# EAGLE schematic Mini_VFD_RevA (EAGLE 9.6.2)
AUTH_NAME: Michael Adam; REV_NO: A
Assembly variants: Assembly_1

## Sheet 1 of 7: General
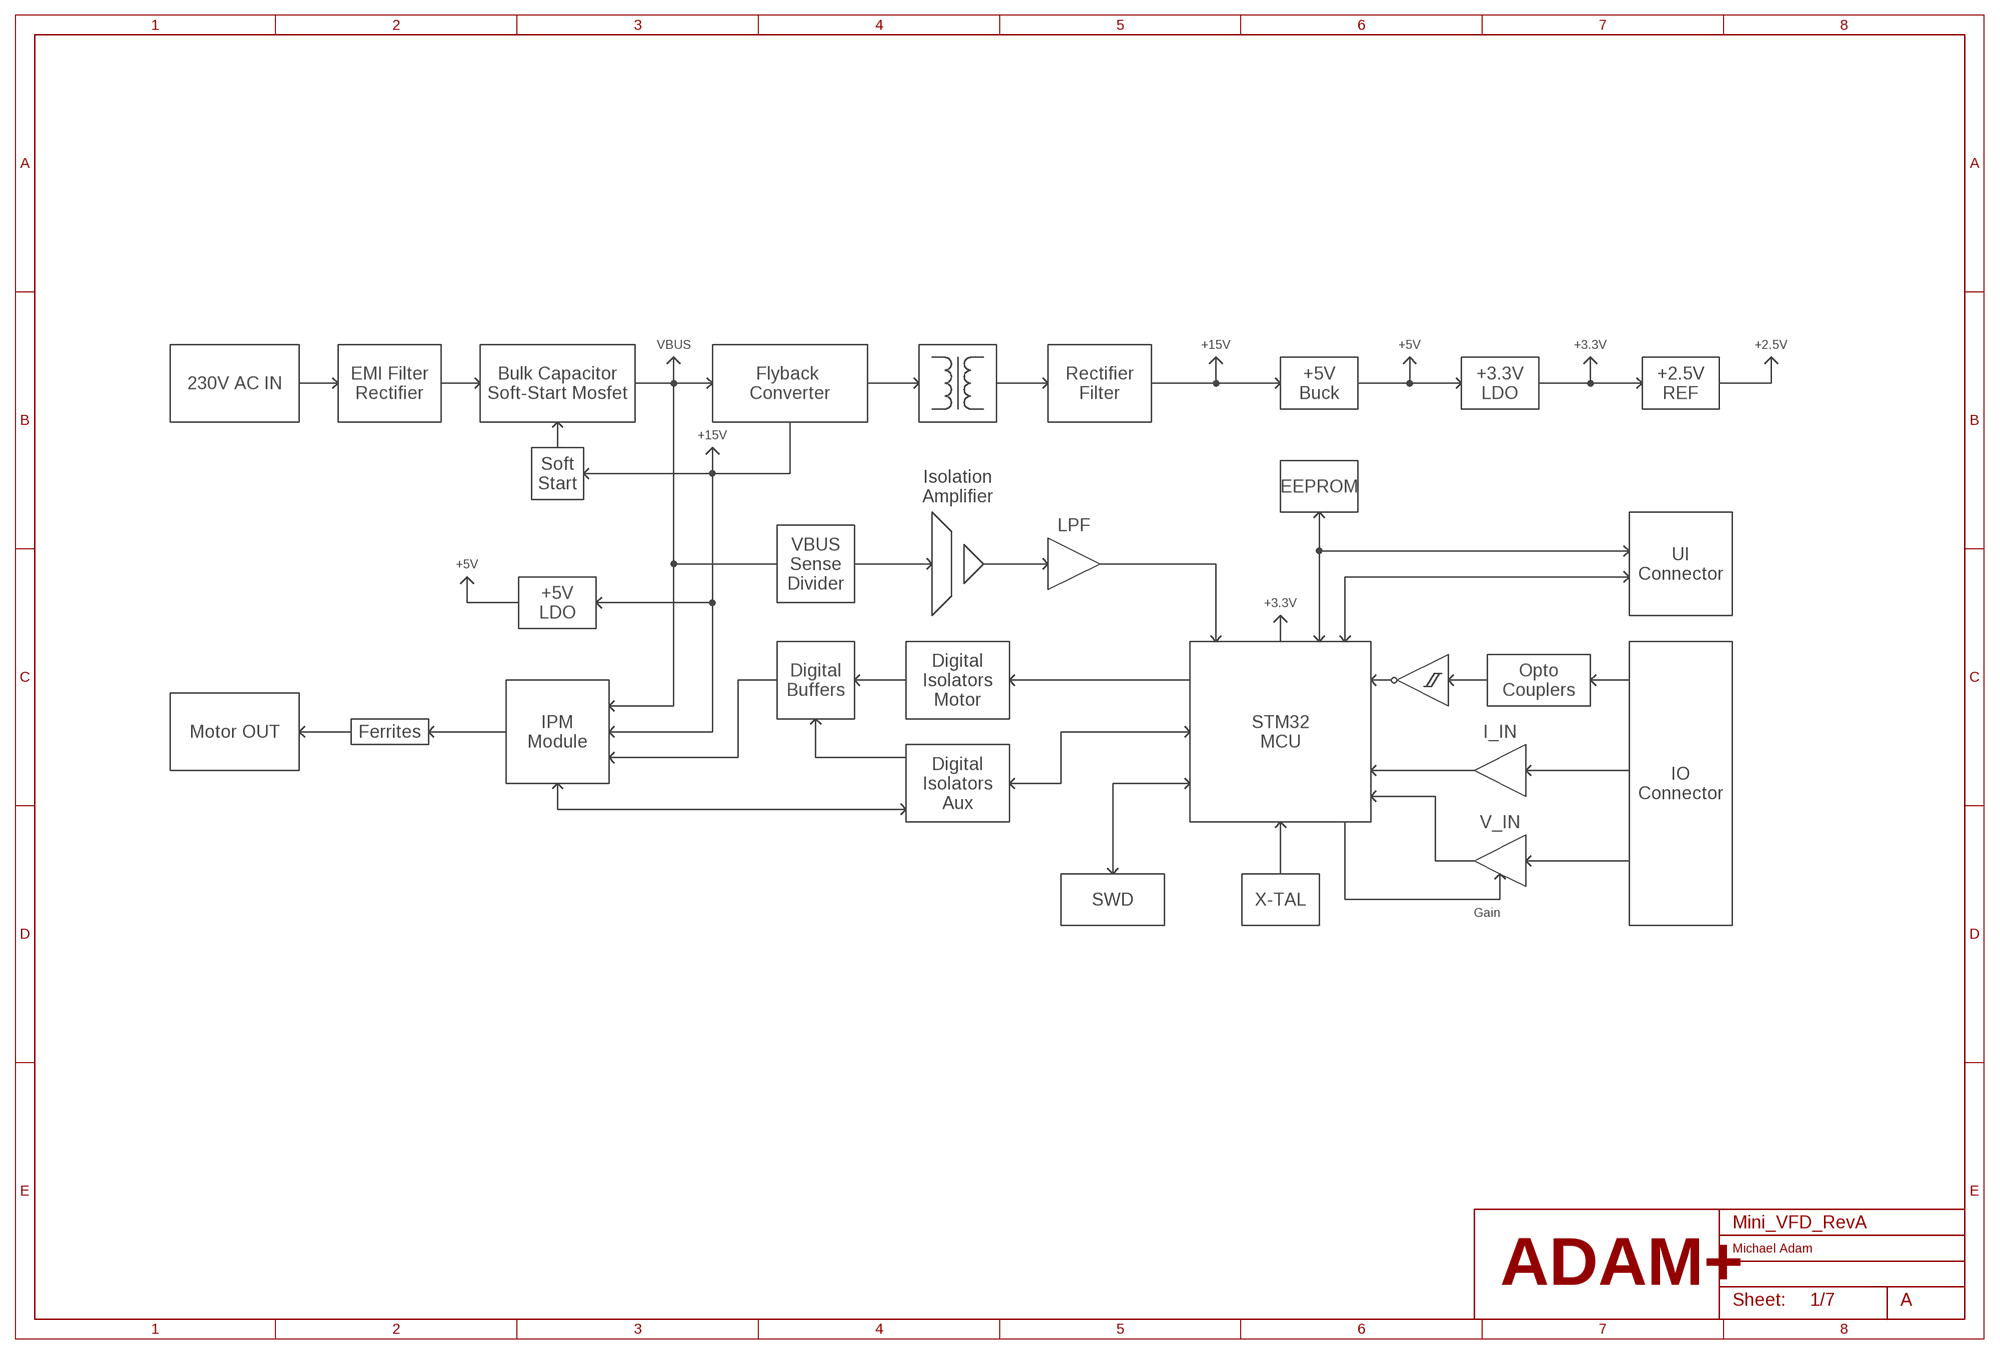
[diagram p0: schematic, sheet 1]

### Notes on the sheet
- VBUS | +15V | +5V | +3.3V | +2.5V
- 230V AC IN
- EMI Filter
  Rectifier
- Bulk Capacitor
  Soft-Start Mosfet
- Flyback 
  Converter
- Rectifier
  Filter
- +5V
  Buck
- +3.3V
  LDO
- +2.5V
  REF
- +15V
- Soft
  Start
- Isolation
  Amplifier
- EEPROM
- LPF
- +5V
- VBUS
  Sense
  Divider
- UI
  Connector
- +5V
  LDO
- +3.3V
- Digital
  Buffers
- Digital
  Isolators
  Motor
- Opto
  Couplers
- Motor OUT | Ferrites
- IPM
  Module
- STM32
  MCU
- I_IN
- Digital
  Isolators
  Aux
- IO
  Connector
- V_IN
- SWD | X-TAL
- Gain

## Sheet 2 of 7: Inputs
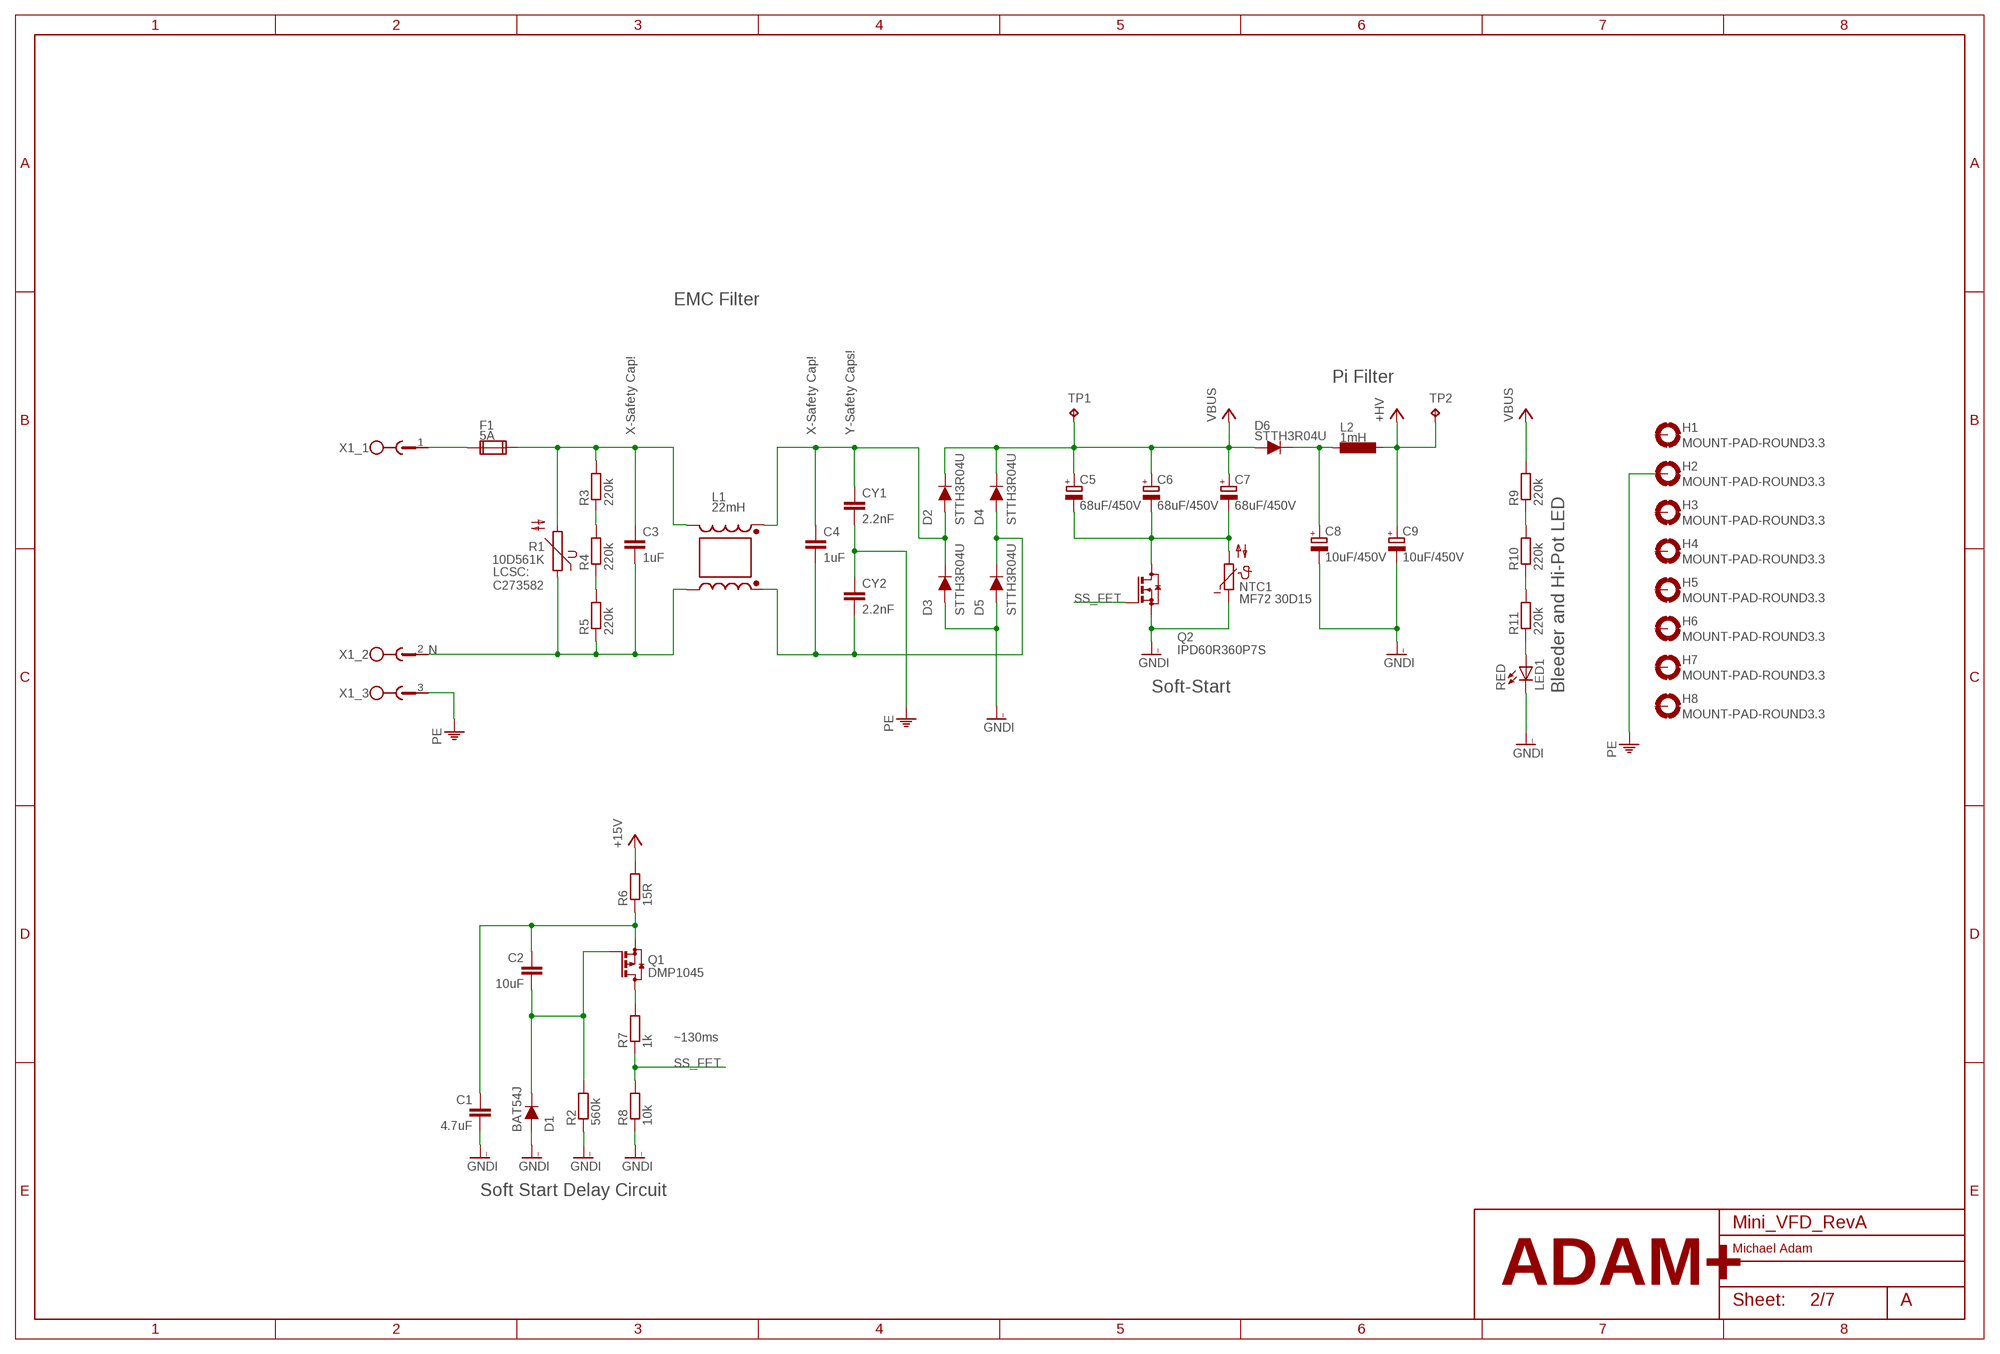
[diagram p1: schematic, sheet 2]

### Parts
C1  4.7uF  C-EUC0805  [C0805]
C2  10uF  C-EUC0805  [C0805]
C3  1uF  C-EU102-082X133  [C102-082X133]
C4  1uF  C-EU102-082X133  [C102-082X133]
C5  68uF/450V  CPOL-EUE7.5-18  [E7,5-18]
C6  68uF/450V  CPOL-EUE7.5-18  [E7,5-18]
C7  68uF/450V  CPOL-EUE7.5-18  [E7,5-18]
C8  10uF/450V  CPOL-EUE5-10.5  [E5-10,5]
C9  10uF/450V  CPOL-EUE5-10.5  [E5-10,5]
CY1  2.2nF  CYYC7B5  [YC7B5]
CY2  2.2nF  CYYC7B5  [YC7B5]
D1  BAT54J  DIODE  [SOD123]
D2  STTH3R04U  DIODESMB  [SMB]
D3  STTH3R04U  DIODESMB  [SMB]
D4  STTH3R04U  DIODESMB  [SMB]
D5  STTH3R04U  DIODESMB  [SMB]
D6  STTH3R04U  DIODESMB  [SMB]
F1  5A  FUSESH25  [SH25]
H1  MOUNT-PAD-ROUND3.3  [3,3-PAD]
H2  MOUNT-PAD-ROUND3.3  [3,3-PAD]
H3  MOUNT-PAD-ROUND3.3  [3,3-PAD]
H4  MOUNT-PAD-ROUND3.3  [3,3-PAD]
H5  MOUNT-PAD-ROUND3.3  [3,3-PAD]
H6  MOUNT-PAD-ROUND3.3  [3,3-PAD]
H7  MOUNT-PAD-ROUND3.3  [3,3-PAD]
H8  MOUNT-PAD-ROUND3.3  [3,3-PAD]
L1  22mH  COMMON_MODE_CHOKE_XRT16128B-223VFRL6  [CMC_PDMCAT18107]
L2  1mH  COIL_1MH  [SLH0704]
LED1  RED  LED_0805  [LED_0805]
NTC1  MF72 30D15  NTC  [MF72]
Q1  DMP1045  PMOS  [SOT23]
Q2  IPD60R360P7S  NMOS_IPD60R360P7S  [TO252]
R1  10D561K  S10K175  [S10K175]
R2  560k  R-EU_R0603  [R0603]
R3  220k  R-EU_R1206  [R1206]
R4  220k  R-EU_R1206  [R1206]
R5  220k  R-EU_R1206  [R1206]
R6  15R  R-EU_0207/10  [0207/10]
R7  1k  R-EU_R0603  [R0603]
R8  10k  R-EU_R0603  [R0603]
R9  220k  R-EU_R1206  [R1206]
R10  220k  R-EU_R1206  [R1206]
R11  220k  R-EU_R1206  [R1206]
TP1  TPTP10R  [TP10R]
TP2  TPTP10R  [TP10R]
X1  MSTBV3  [MSTBV3]

### Nets
+15V: R6.2 ; also sheet 3,4
+HV [High_Voltage]: C9.+ L2.1 TP2.TP ; also sheet 3
C_NEG: C5.- C6.- C7.- NTC1.2 Q2.3(D)
GNDI: C1.2 C8.- C9.- D1.2(A) D3.A D5.A LED1.C NTC1.1 Q2.2(S) R2.1 R8.1 ; also sheet 3,4,5
L: F1.1 X1.1
L_FILT [High_Voltage]: C4.1 CY1.1 D2.A D3.C L1.IN1
L_FUSED: C3.1 F1.2 L1.OUT1 R1.2 R3.2
N: C3.2 L1.OUT2 R1.1 R5.1 X1.2
N$1: Q1.3(D) R7.2
N$12: C2.2 D1.1(C) Q1.1(G) R2.2
N$14: C1.1 C2.1 Q1.2(S) R6.1
N$44: R3.1 R4.2
N$45: R4.1 R5.2
N$59: R9.1 R10.2
N$63: R10.1 R11.2
N$64: LED1.A R11.1
N_FILT [High_Voltage]: C4.2 CY2.2 D4.A D5.C L1.IN2
PE: CY1.2 CY2.1 H2.B3,3(MOUNT) X1.3 ; also sheet 4
SS_FET: Q2.1(G) R7.1 R8.2
VBUS [High_Voltage]: C5.+ C6.+ C7.+ D2.C D4.C D6.A R9.2 TP1.TP ; also sheet 4,5
VBUS_FILT [High_Voltage]: C8.+ D6.C L2.2
Unconnected: H1.B3,3(MOUNT) H3.B3,3(MOUNT) H4.B3,3(MOUNT) H5.B3,3(MOUNT) H6.B3,3(MOUNT) H7.B3,3(MOUNT) H8.B3,3(MOUNT)

### Notes on the sheet
- EMC Filter
- Pi Filter
- X-Safety Cap! | X-Safety Cap! | Y-Safety Caps!
- LCSC:
  C273582
- Soft-Start | Bleeder and Hi-Pot LED
- ~130ms
- Soft Start Delay Circuit

## Sheet 3 of 7: Inputs
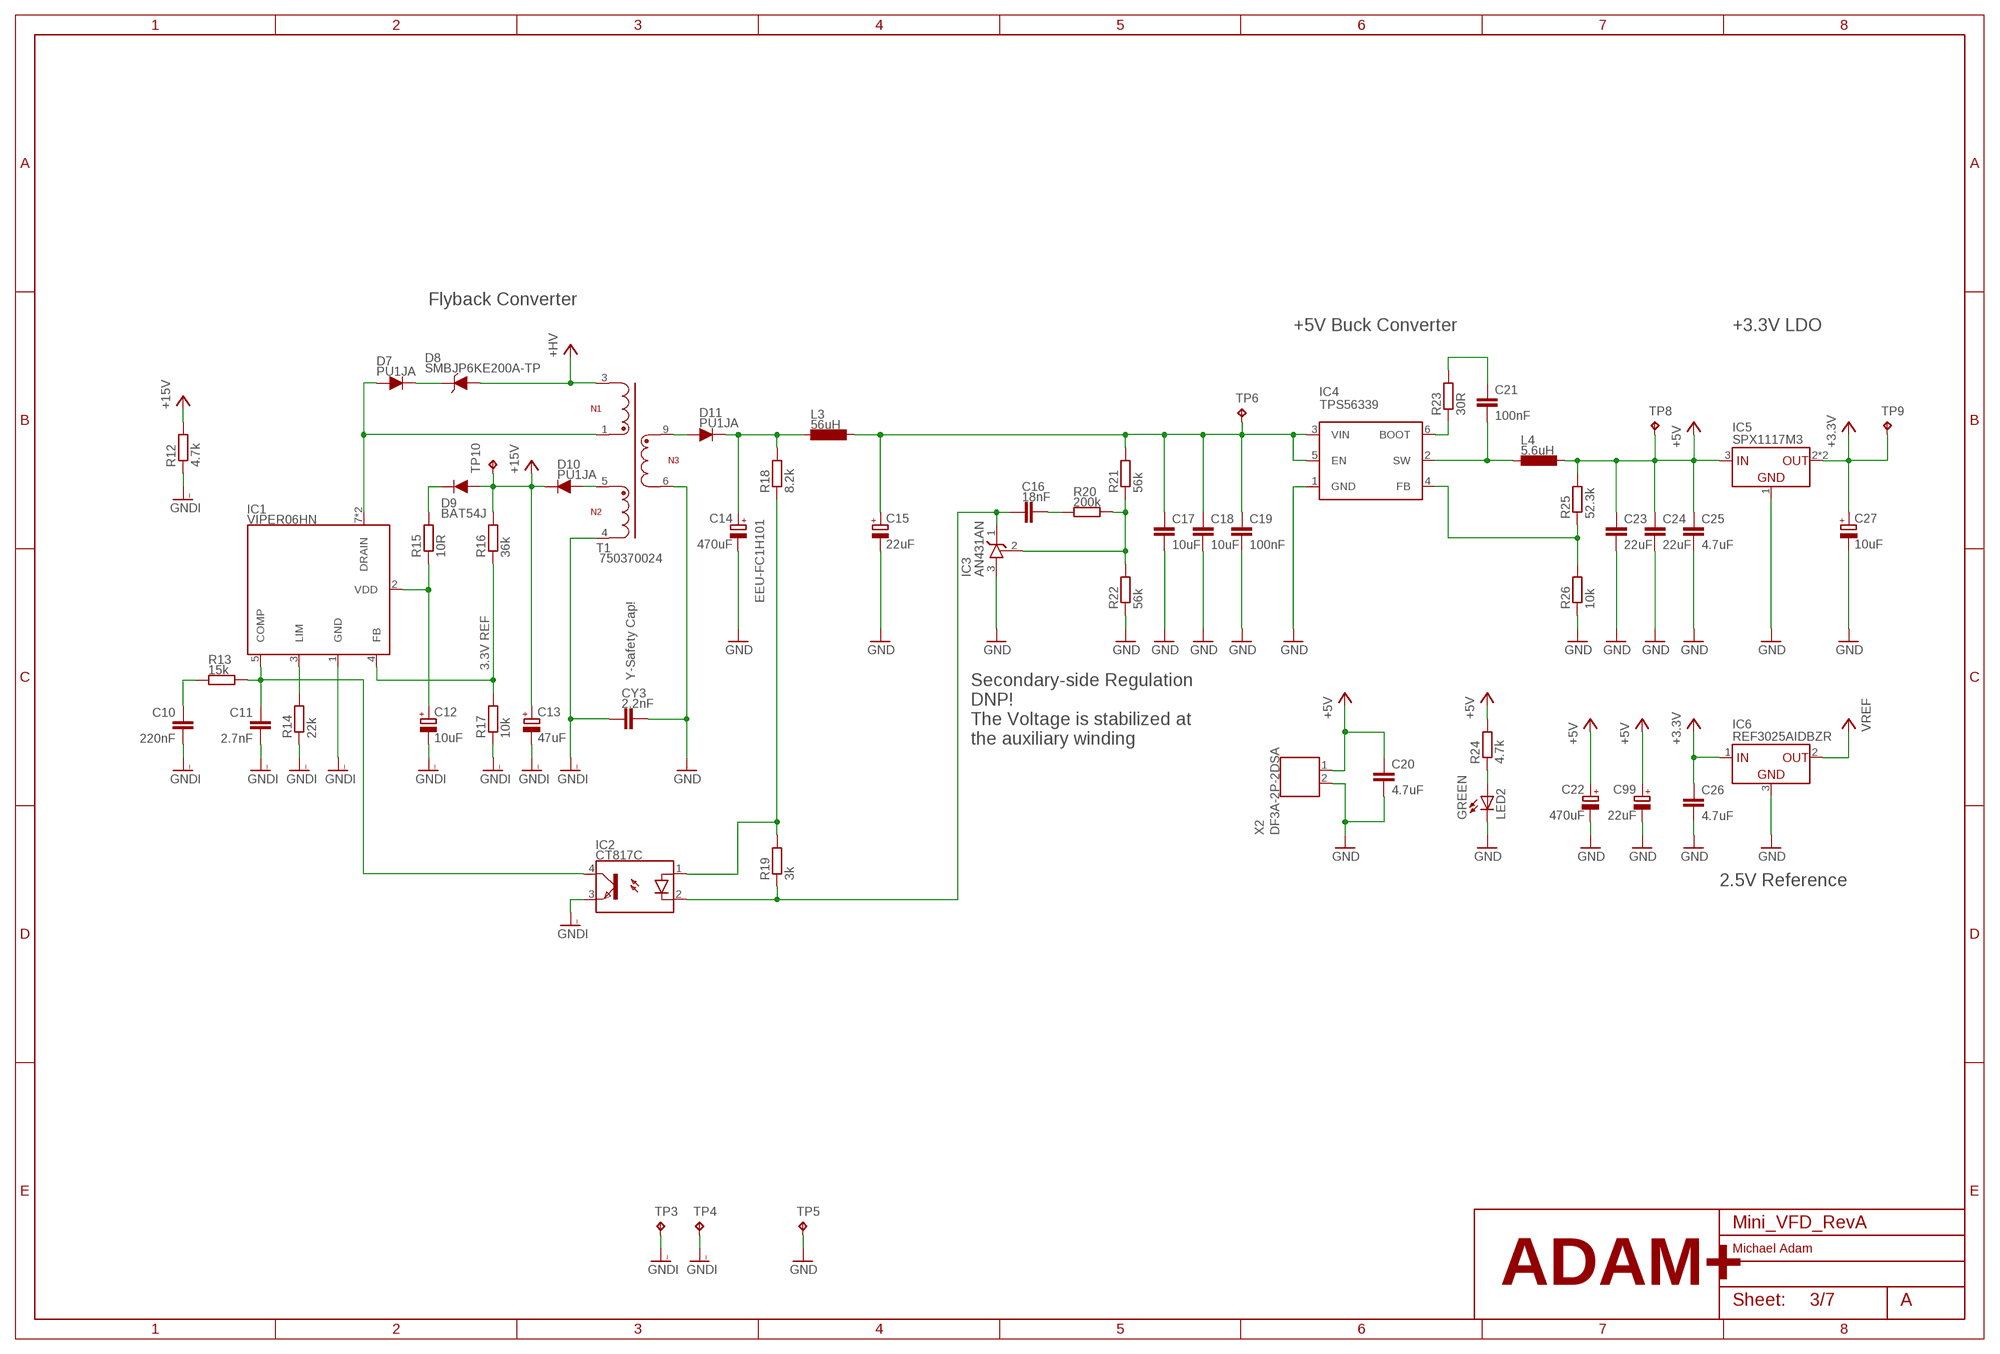
[diagram p2: schematic, sheet 3]

### Parts
C10  220nF  C-EUC0603  [C0603]
C11  2.7nF  C-EUC0603  [C0603]
C12  10uF  CPOL-EUE2.5-5  [E2,5-5]
C13  47uF  CPOL-EUE2.5-7  [E2,5-7]
C14  470uF  CPOL-EUE5-10.5  [E5-10,5]
C15  22uF  CPOL-EUE2-5  [E2-5]
C16  18nF  C-EUC0603  [C0603]  (not fitted in variant Assembly_1)
C17  10uF  C-EUC1206  [C1206]
C18  10uF  C-EUC1206  [C1206]
C19  100nF  C-EUC0603  [C0603]
C20  4.7uF  C-EUC0805  [C0805]
C21  100nF  C-EUC0603  [C0603]
C22  470uF  CPOL-EUE5-10.5  [E5-10,5]
C23  22uF  C-EUC1206  [C1206]
C24  22uF  C-EUC1206  [C1206]
C25  4.7uF  C-EUC0603  [C0603]
C26  4.7uF  C-EUC0603  [C0603]
C27  10uF  CPOL-EUCT3528  [CT3528]
C99  22uF  CPOL-EUE2-5  [E2-5]
CY3  2.2nF  CYYC7B5  [YC7B5]
D7  PU1JA  DIODEDO214AC  [DO214AC]
D8  SMBJP6KE200A-TP  TVS_DIODE_UNISMB  [SMB]
D9  BAT54J  DIODE  [SOD123]
D10  PU1JA  DIODEDO214AC  [DO214AC]
D11  PU1JA  DIODEDO214AC  [DO214AC]
IC1  VIPER06HN  [DIL07]
IC2  CT817C  [SMD4]  (not fitted in variant Assembly_1)
IC3  AN431AN  431  [SOT23]  (not fitted in variant Assembly_1)
IC4  TPS56339  [TSOT23-6]
IC5  SPX1117M3  SPX1117_3V3  [SOT223]
IC6  REF3025AIDBZR  REF3025  [SOT23]
L3  56uH  COIL_56UH  [PDPTAT]
L4  5.6uH  COIL_5R6  [DH0530H]
LED2  GREEN  LED_0805  [LED_0805]
R12  4.7k  R-EU_R1206  [R1206]
R13  15k  R-EU_R0603  [R0603]
R14  22k  R-EU_R0603  [R0603]
R15  10R  R-EU_R0805  [R0805]
R16  36k  R-EU_R0603  [R0603]
R17  10k  R-EU_R0603  [R0603]
R18  8.2k  R-EU_R0603  [R0603]  (not fitted in variant Assembly_1)
R19  3k  R-EU_R0603  [R0603]  (not fitted in variant Assembly_1)
R20  200k  R-EU_R0603  [R0603]  (not fitted in variant Assembly_1)
R21  56k  R-EU_R0603  [R0603]  (not fitted in variant Assembly_1)
R22  56k  R-EU_R0603  [R0603]  (not fitted in variant Assembly_1)
R23  30R  R-EU_R0603  [R0603]
R24  4.7k  R-EU_R0603  [R0603]
R25  52.3k  R-EU_R0603  [R0603]
R26  10k  R-EU_R0603  [R0603]
T1  750370024  750370024  [WE-OLSTM_EE13_L13.72W20.45H10.8]
TP3  TP_SOLDREYE  [SOLDER_EYE]
TP4  TP_SOLDREYE  [SOLDER_EYE]
TP5  TP_SOLDREYE  [SOLDER_EYE]
TP6  TP_SOLDREYE  [SOLDER_EYE]
TP8  TP_SOLDREYE  [SOLDER_EYE]
TP9  TP_SOLDREYE  [SOLDER_EYE]
TP10  TP_SOLDREYE  [SOLDER_EYE]
X2  DF3A-2P-2DSA  DF3E-2P-2V_THD  [DF3A-2P-2DSA]

### Nets
+3.3V: C26.1 C27.+ IC5.2(VOUT) IC5.4(VOUT) IC6.1(VIN) TP9.1(TP) ; also sheet 5,6,7
+5V: C20.1 C22.+ C23.1 C24.1 C25.1 C99.+ IC5.3(VIN) L4.P$1 R24.2 R25.2 TP8.1(TP) X2.1 ; also sheet 6,7
+15V: C13.+ D9.2(A) D10.C R12.2 R16.2 TP10.1(TP) ; also sheet 2,4
+HV [High_Voltage]: D8.A T1.3 ; also sheet 2
AUX_OUT: D10.A T1.5
BOOT_+5V: IC4.6(BOOT) R23.1
D [High_Voltage]: D7.A IC1.7(DRAIN) IC1.8(DRAIN) T1.1
FB: IC4.4(FB) R25.1 R26.2
GND: C14.- C15.- C17.2 C18.2 C19.2 C20.2 C22.- C23.2 C24.2 C25.2 C26.2 C27.- C99.- CY3.2 IC3.3(A) IC4.1(GND) IC5.1(GND) IC6.3(GND) LED2.C R22.1 R26.1 T1.6 TP5.1(TP) X2.2 ; also sheet 5,6,7
GNDI: C10.2 C11.2 C12.- C13.- CY3.1 IC1.1(GND) IC2.3(EMIT) R12.1 R14.1 R17.1 T1.4 TP3.1(TP) TP4.1(TP) ; also sheet 2,4,5
N$48: D9.1(C) R15.2
N$50: IC1.3(LIM) R14.2
N$52: IC1.4(FB) R16.1 R17.2
N$55: C10.1 R13.1
N$56: IC3.2(R) R20.2 R21.1 R22.2
N$57: D7.C D8.C
N$60: C11.1 IC1.5(COMP) IC2.4(COL) R13.2
N$62: C16.1 IC2.2(C) IC3.1(C) R19.1
N$67: IC2.1(A) R18.1 R19.2
N$68: LED2.A R24.1
N$69: C16.2 R20.1
N$75: C21.1 R23.2
SEC_OUT: D11.A T1.9
SW: C21.2 IC4.2(SW) L4.P$2
V_AUX: C12.+ IC1.2(VDD) R15.1
VDD: C14.+ D11.C L3.2 R18.2
VDD_FILT: C15.+ C17.1 C18.1 C19.1 IC4.3(VIN) IC4.5(EN) L3.1 R21.2 TP6.1(TP)
VREF: IC6.2(VOUT) ; also sheet 7

### Notes on the sheet
- Flyback Converter
- +5V Buck Converter | +3.3V LDO
- EEU-FC1H101
- 3.3V REF
- Y-Safety Cap!
- Secondary-side Regulation
  DNP!
  The Voltage is stabilized at 
  the auxiliary winding
- 2.5V Reference

## Sheet 4 of 7: Outputs
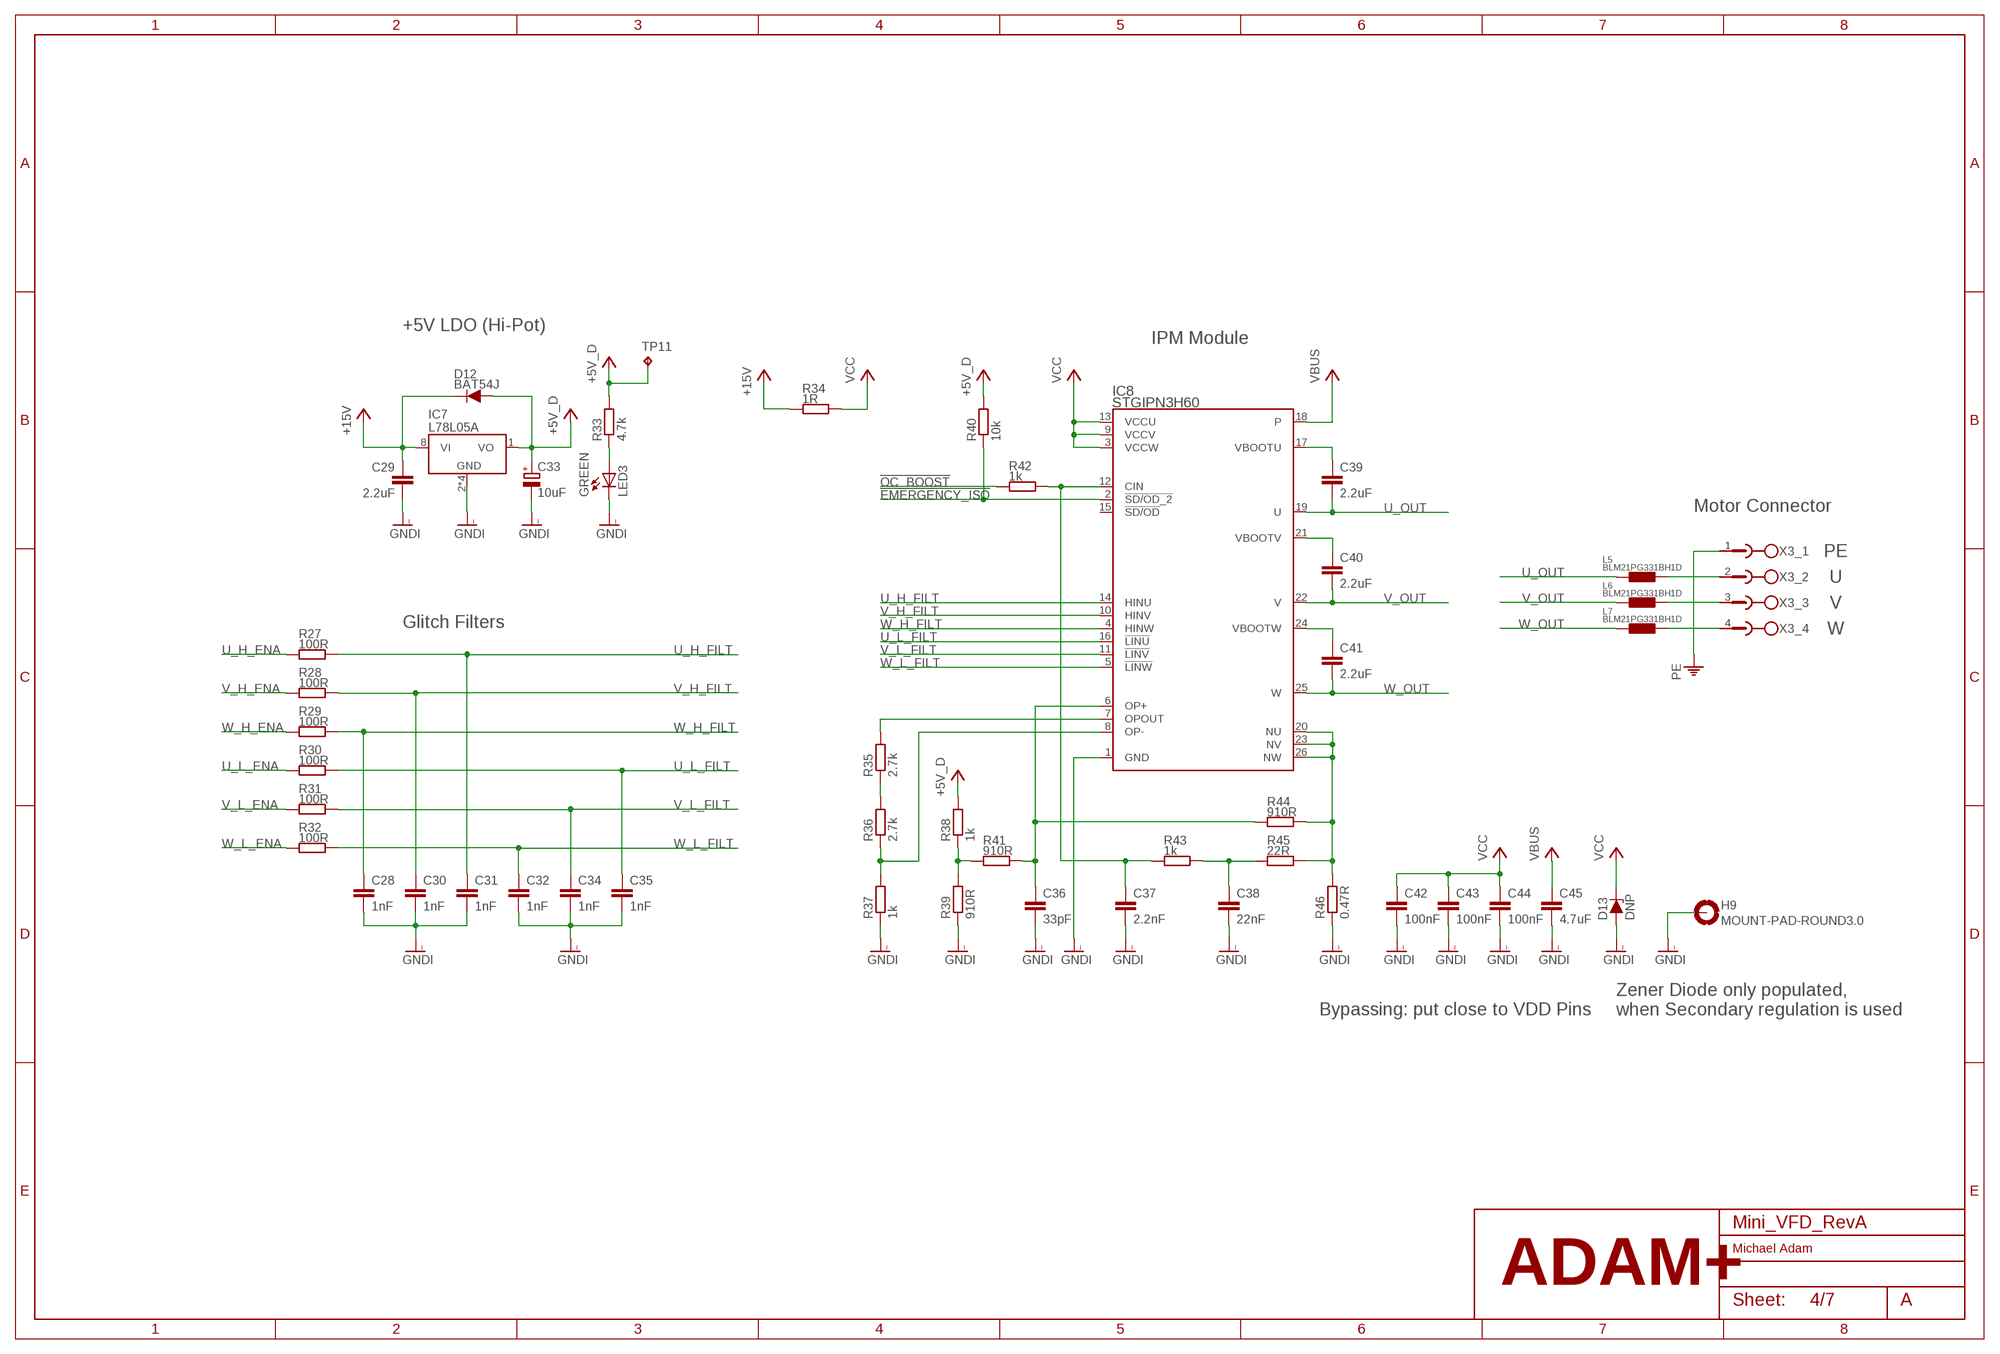
[diagram p3: schematic, sheet 4]

### Parts
C28  1nF  C-EUC0603  [C0603]
C29  2.2uF  C-EUC0805  [C0805]
C30  1nF  C-EUC0603  [C0603]
C31  1nF  C-EUC0603  [C0603]
C32  1nF  C-EUC0603  [C0603]
C33  10uF  CPOL-EUCT3528  [CT3528]
C34  1nF  C-EUC0603  [C0603]
C35  1nF  C-EUC0603  [C0603]
C36  33pF  C-EUC0603  [C0603]
C37  2.2nF  C-EUC0603  [C0603]
C38  22nF  C-EUC0603  [C0603]
C39  2.2uF  C-EUC0805  [C0805]
C40  2.2uF  C-EUC0805  [C0805]
C41  2.2uF  C-EUC0805  [C0805]
C42  100nF  C-EUC0603  [C0603]
C43  100nF  C-EUC0603  [C0603]
C44  100nF  C-EUC0603  [C0603]
C45  4.7uF  C-EU275-126X316  [C275-126X316]
D12  BAT54J  DIODE  [SOD123]
D13  DNP  ZENERSMA  [DO214AC]
H9  MOUNT-PAD-ROUND3.0  [3,0-PAD]
IC7  L78L05A  78L05  [SOIC8]
IC8  STGIPN3H60  [NDIP26_12P45X29P25_STM]
L5  BLM21PG331BH1D  BEAD0805  [R0805]
L6  BLM21PG331BH1D  BEAD0805  [R0805]
L7  BLM21PG331BH1D  BEAD0805  [R0805]
LED3  GREEN  LED_0805  [LED_0805]
R27  100R  R-EU_R0603  [R0603]
R28  100R  R-EU_R0603  [R0603]
R29  100R  R-EU_R0603  [R0603]
R30  100R  R-EU_R0603  [R0603]
R31  100R  R-EU_R0603  [R0603]
R32  100R  R-EU_R0603  [R0603]
R33  4.7k  R-EU_R0603  [R0603]
R34  1R  R-EU_R0805  [R0805]
R35  2.7k  R-EU_R0603  [R0603]
R36  2.7k  R-EU_R0603  [R0603]
R37  1k  R-EU_R0603  [R0603]
R38  1k  R-EU_R0603  [R0603]
R39  910R  R-EU_R0603  [R0603]
R40  10k  R-EU_R0603  [R0603]
R41  910R  R-EU_R0603  [R0603]
R42  1k  R-EU_R0603  [R0603]
R43  1k  R-EU_R0603  [R0603]
R44  910R  R-EU_R0603  [R0603]
R45  22R  R-EU_R0603  [R0603]
R46  0.47R  R-EU_R2512  [R2512]
TP11  TP_SOLDREYE  [SOLDER_EYE]
X3  MSTBV4MTSV  [MSTBV4]

### Nets
!EMERGENCY_ISO: IC8.2(!SD/OD_2) R40.1 ; also sheet 5
!OC_BOOST: R42.1 ; also sheet 5
+5V_D: C33.+ D12.2(A) IC7.1(VO) R33.2 R38.2 R40.2 TP11.1(TP) ; also sheet 5
+15V: C29.1 D12.1(C) IC7.8(VI) R34.1 ; also sheet 2,3
BOOT_U [High_Voltage]: C39.1 IC8.17(VBOOTU)
BOOT_V [High_Voltage]: C40.1 IC8.21(VBOOTV)
BOOT_W [High_Voltage]: C41.1 IC8.24(VBOOTW)
GNDI: C28.2 C29.2 C30.2 C31.2 C32.2 C33.- C34.2 C35.2 C36.2 C37.2 C38.2 C42.2 C43.2 C44.2 C45.2 D13.A H9.B3,0(MOUNT) IC7.2(GND) IC7.3(GND) IC7.6(GND) IC7.7(GND) IC8.1(GND) LED3.C R37.1 R39.1 R46.1 ; also sheet 2,3,5
N$2: LED3.A R33.1
N$5: C38.1 R43.2 R45.1
N$6: C37.1 IC8.12(CIN) R42.2 R43.1
N$7: IC8.8(OP-) R36.1 R37.2
N$8: R35.1 R36.2
N$9: IC8.7(OPOUT) R35.2
N$22: R38.1 R39.2 R41.1
N$38: C36.1 IC8.6(OP+) R41.2 R44.1
N_COM: IC8.20(NU) IC8.23(NV) IC8.26(NW) R44.2 R45.2 R46.2
PE: X3.1 ; also sheet 2
U [High_Voltage]: L5.2 X3.2
U_H_ENA: R27.1 ; also sheet 5
U_H_FILT: C31.1 IC8.14(HINU) R27.2
U_L_ENA: R30.1 ; also sheet 5
U_L_FILT: C35.1 IC8.16(!LINU) R30.2
U_OUT [High_Voltage]: C39.2 IC8.19(U) L5.1
V [High_Voltage]: L6.2 X3.3
V_H_ENA: R28.1 ; also sheet 5
V_H_FILT: C30.1 IC8.10(HINV) R28.2
V_L_ENA: R31.1 ; also sheet 5
V_L_FILT: C34.1 IC8.11(!LINV) R31.2
V_OUT [High_Voltage]: C40.2 IC8.22(V) L6.1
VBUS [High_Voltage]: C45.1 IC8.18(P) ; also sheet 2,5
VCC: C42.1 C43.1 C44.1 D13.C IC8.3(VCCW) IC8.9(VCCV) IC8.13(VCCU) R34.2
W [High_Voltage]: L7.2 X3.4
W_H_ENA: R29.1 ; also sheet 5
W_H_FILT: C28.1 IC8.4(HINW) R29.2
W_L_ENA: R32.1 ; also sheet 5
W_L_FILT: C32.1 IC8.5(!LINW) R32.2
W_OUT [High_Voltage]: C41.2 IC8.25(W) L7.1
Unconnected: IC8.15(!SD/OD)

### Notes on the sheet
- +5V LDO (Hi-Pot)
- IPM Module
- Motor Connector
- PE
- U
- V
- Glitch Filters | W
- Bypassing: put close to VDD Pins
- Zener Diode only populated, 
  when Secondary regulation is used

## Sheet 5 of 7
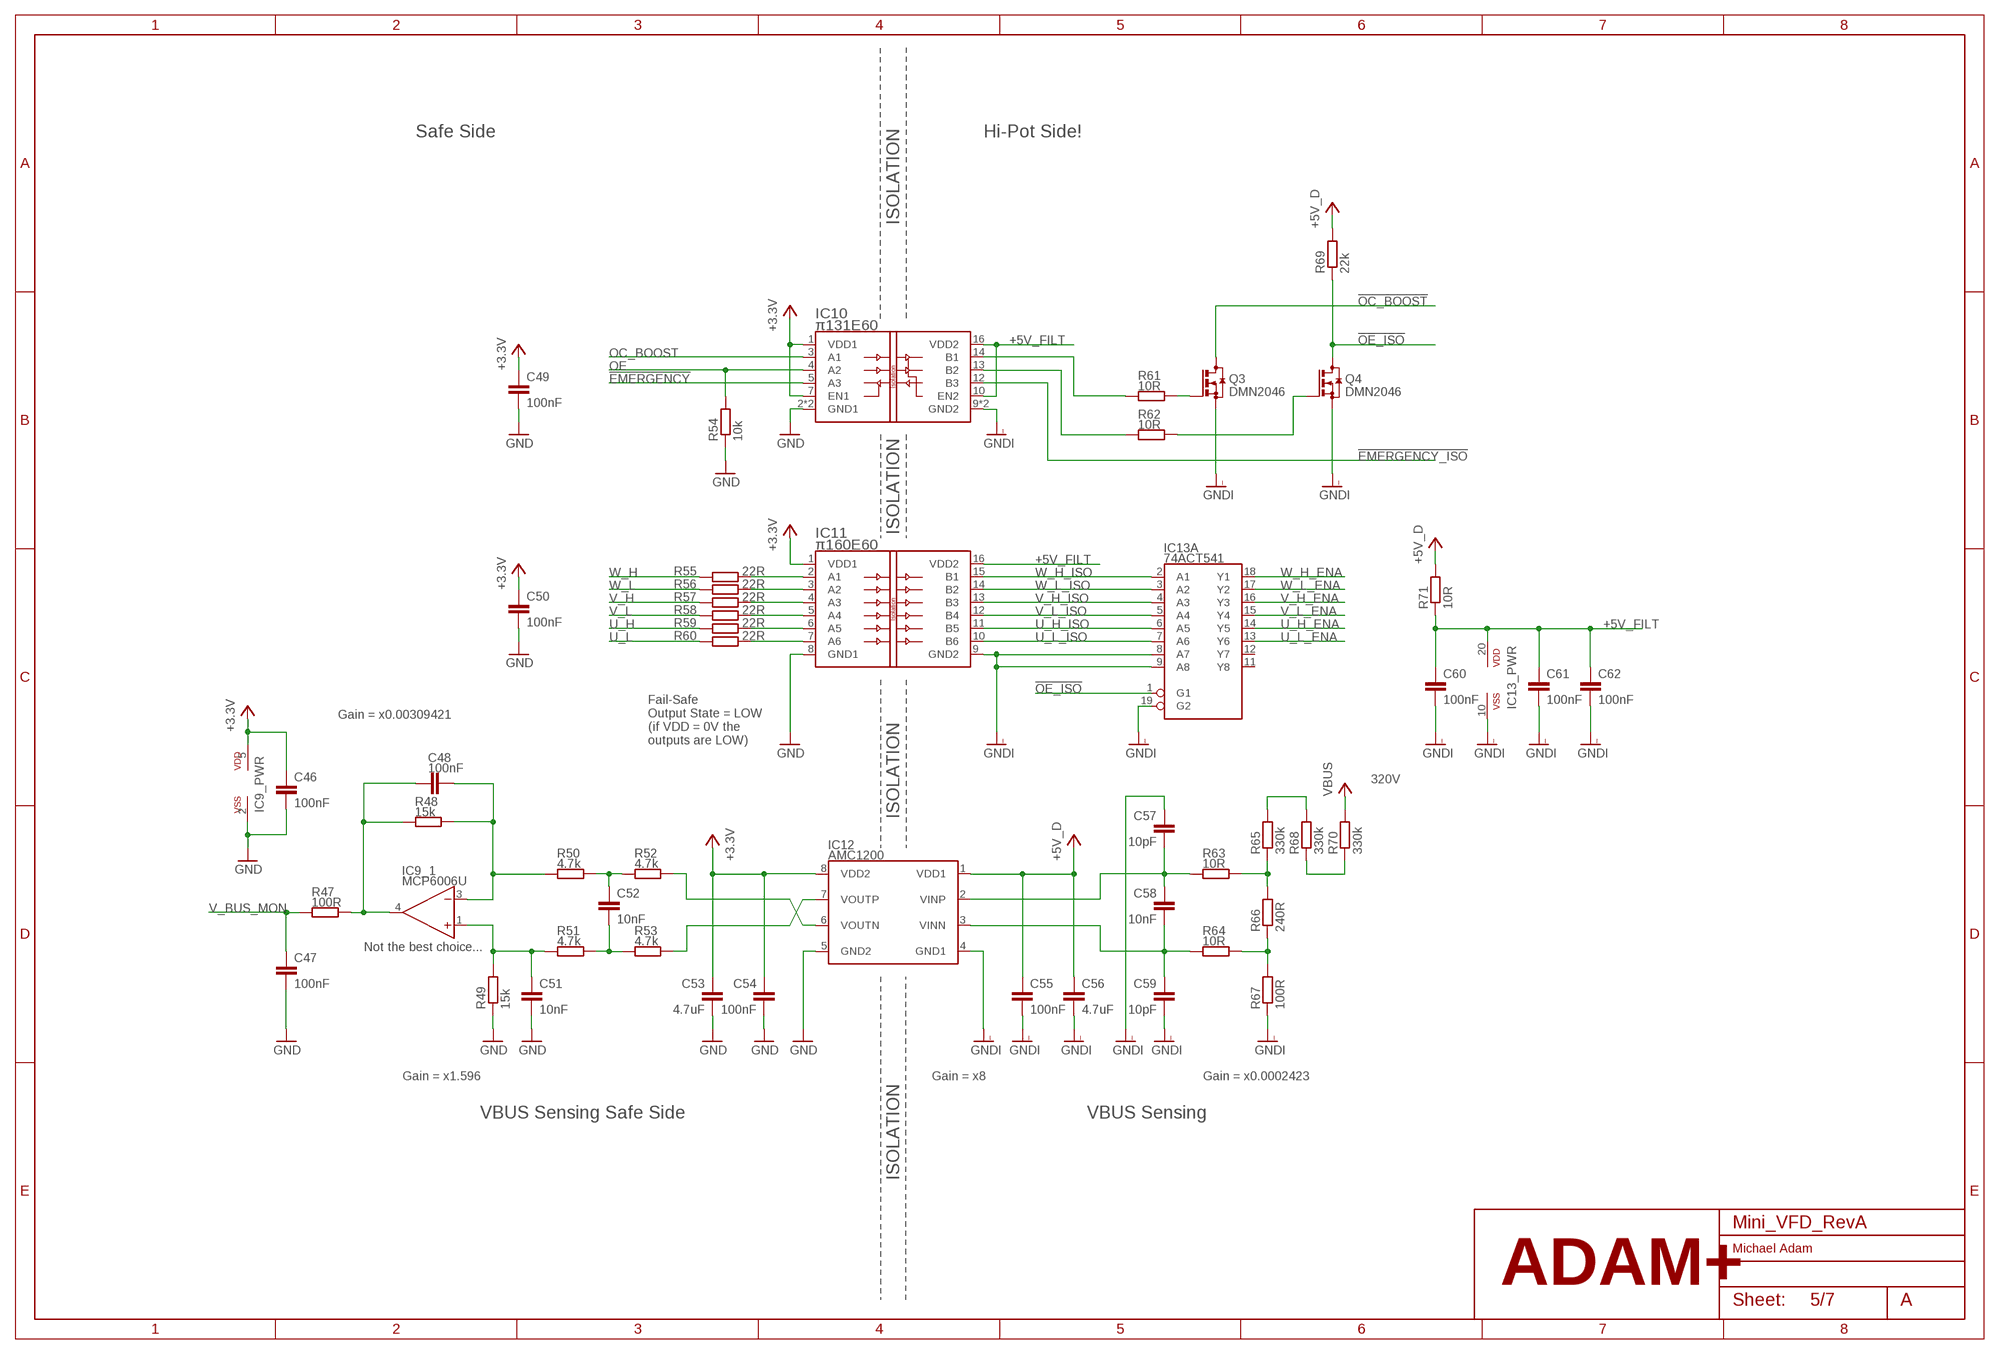
[diagram p4: schematic, sheet 5]

### Parts
C46  100nF  C-EUC0603  [C0603]
C47  100nF  C-EUC0603  [C0603]
C48  100nF  C-EUC0603  [C0603]
C49  100nF  C-EUC0603  [C0603]
C50  100nF  C-EUC0603  [C0603]
C51  10nF  C-EUC0603  [C0603]
C52  10nF  C-EUC0603  [C0603]
C53  4.7uF  C-EUC0603  [C0603]
C54  100nF  C-EUC0603  [C0603]
C55  100nF  C-EUC0603  [C0603]
C56  4.7uF  C-EUC0603  [C0603]
C57  10pF  C-EUC0603  [C0603]
C58  10nF  C-EUC0603  [C0603]
C59  10pF  C-EUC0603  [C0603]
C60  100nF  C-EUC0603  [C0603]
C61  100nF  C-EUC0603  [C0603]
C62  100nF  C-EUC0603  [C0603]
IC9  MCP6006U  LM321  [SOT23-5]
IC10  π131E60  [SOIC16R]
IC11  π160E60  [SOIC16R]
IC12  AMC1200  [SOIC8_W]
IC13  74ACT541  74541  [SOIC20NS]
Q3  DMN2046  NMOS_DMN2046  [SOT23]
Q4  DMN2046  NMOS_DMN2046  [SOT23]
R47  100R  R-EU_R0603  [R0603]
R48  15k  R-EU_R0603  [R0603]
R49  15k  R-EU_R0603  [R0603]
R50  4.7k  R-EU_R0603  [R0603]
R51  4.7k  R-EU_R0603  [R0603]
R52  4.7k  R-EU_R0603  [R0603]
R53  4.7k  R-EU_R0603  [R0603]
R54  10k  R-EU_R0603  [R0603]
R55  22R  R-EU_R0603  [R0603]
R56  22R  R-EU_R0603  [R0603]
R57  22R  R-EU_R0603  [R0603]
R58  22R  R-EU_R0603  [R0603]
R59  22R  R-EU_R0603  [R0603]
R60  22R  R-EU_R0603  [R0603]
R61  10R  R-EU_R0603  [R0603]
R62  10R  R-EU_R0603  [R0603]
R63  10R  R-EU_R0603  [R0603]
R64  10R  R-EU_R0603  [R0603]
R65  330k  R-EU_R1206  [R1206]
R66  240R  R-EU_R0603  [R0603]
R67  100R  R-EU_R0603  [R0603]
R68  330k  R-EU_R1206  [R1206]
R69  22k  R-EU_R0603  [R0603]
R70  330k  R-EU_R1206  [R1206]
R71  10R  R-EU_R0603  [R0603]

### Nets
!EMERGENCY: IC10.5(A3) ; also sheet 7
!EMERGENCY_ISO: IC10.12(B3) ; also sheet 4
!OC_BOOST: Q3.3(D) ; also sheet 4
!OE_ISO: IC13.1(A:G1) Q4.3(D) R69.1
+3.3V: C46.1 C49.1 C50.1 C53.1 C54.1 IC9.5(_PWR:VDD) IC10.1(VDD1) IC10.7(EN1) IC11.1(VDD1) IC12.8(VDD2) ; also sheet 3,6,7
+5V_D: C55.1 C56.1 IC12.1(VDD1) R69.2 R71.2 ; also sheet 4
+5V_FILT: C60.1 C61.1 C62.1 IC10.10(EN2) IC10.16(VDD2) IC11.16(VDD2) IC13.20(_PWR:VDD) R71.1
GND: C46.2 C47.2 C49.2 C50.2 C51.2 C53.2 C54.2 IC9.2(_PWR:VSS) IC10.2(GND1) IC10.8(GND1) IC11.8(GND1) IC12.5(GND2) R49.1 R54.1 ; also sheet 3,6,7
GNDI: C55.2 C56.2 C57.1 C59.2 C60.2 C61.2 C62.2 IC10.9(GND2) IC10.15(GND2) IC11.9(GND2) IC12.4(GND1) IC13.8(A:A7) IC13.9(A:A8) IC13.10(_PWR:VSS) IC13.19(A:G2) Q3.2(S) Q4.2(S) R67.1 ; also sheet 2,3,4
N$3: Q3.1(G) R61.2
N$13: IC12.6(VOUTN) R52.1
N$15: IC11.2(A1) R55.2
N$16: IC11.3(A2) R56.2
N$17: IC11.4(A3) R57.2
N$25: IC10.14(B1) R61.1
N$29: R64.1 R66.1 R67.2
N$30: IC11.5(A4) R58.2
N$31: IC10.13(B2) R62.1
N$32: IC11.6(A5) R59.2
N$33: IC11.7(A6) R60.2
N$42: Q4.1(G) R62.2
N$53: R68.1 R70.1
N$54: R65.2 R68.2
N$77: IC12.7(VOUTP) R53.1
N$78: C52.1 R50.1 R52.2
N$79: C52.2 R51.1 R53.2
N$80: C48.2 IC9.3(_1:-IN) R48.1 R50.2
N$81: C51.1 IC9.1(_1:+IN) R49.2 R51.2
N$82: C48.1 IC9.4(_1:OUT) R47.1 R48.2
OC_BOOST: IC10.3(A1) ; also sheet 7
OE: IC10.4(A2) R54.2 ; also sheet 7
U_H: R59.1 ; also sheet 7
U_H_ENA: IC13.14(A:Y5) ; also sheet 4
U_H_ISO: IC11.11(B5) IC13.6(A:A5)
U_L: R60.1 ; also sheet 7
U_L_ENA: IC13.13(A:Y6) ; also sheet 4
U_L_ISO: IC11.10(B6) IC13.7(A:A6)
V_BUS_MON: C47.1 R47.2 ; also sheet 7
V_H: R57.1 ; also sheet 7
V_H_ENA: IC13.16(A:Y3) ; also sheet 4
V_H_ISO: IC11.13(B3) IC13.4(A:A3)
V_L: R58.1 ; also sheet 7
V_L_ENA: IC13.15(A:Y4) ; also sheet 4
V_L_ISO: IC11.12(B4) IC13.5(A:A4)
VBUS [High_Voltage]: R70.2 ; also sheet 2,4
VBUS_MON: C57.2 C58.1 IC12.2(VINP) R63.2
VBUS_MON_ATT: R63.1 R65.1 R66.2
VBUS_MON_NEG: C58.2 C59.1 IC12.3(VINN) R64.2
W_H: R55.1 ; also sheet 7
W_H_ENA: IC13.18(A:Y1) ; also sheet 4
W_H_ISO: IC11.15(B1) IC13.2(A:A1)
W_L: R56.1 ; also sheet 7
W_L_ENA: IC13.17(A:Y2) ; also sheet 4
W_L_ISO: IC11.14(B2) IC13.3(A:A2)
Unconnected: IC13.11(A:Y8) IC13.12(A:Y7)

### Notes on the sheet
- Safe Side | Hi-Pot Side!
- ISOLATION
- ISOLATION
- Gain = x0.00309421
- Fail-Safe 
  Output State = LOW
  (if VDD = 0V the 
  outputs are LOW)
- ISOLATION
- 320V
- Not the best choice...
- Gain = x1.596 | Gain = x8 | Gain = x0.0002423
- VBUS Sensing Safe Side | VBUS Sensing
- ISOLATION

## Sheet 6 of 7: Processor
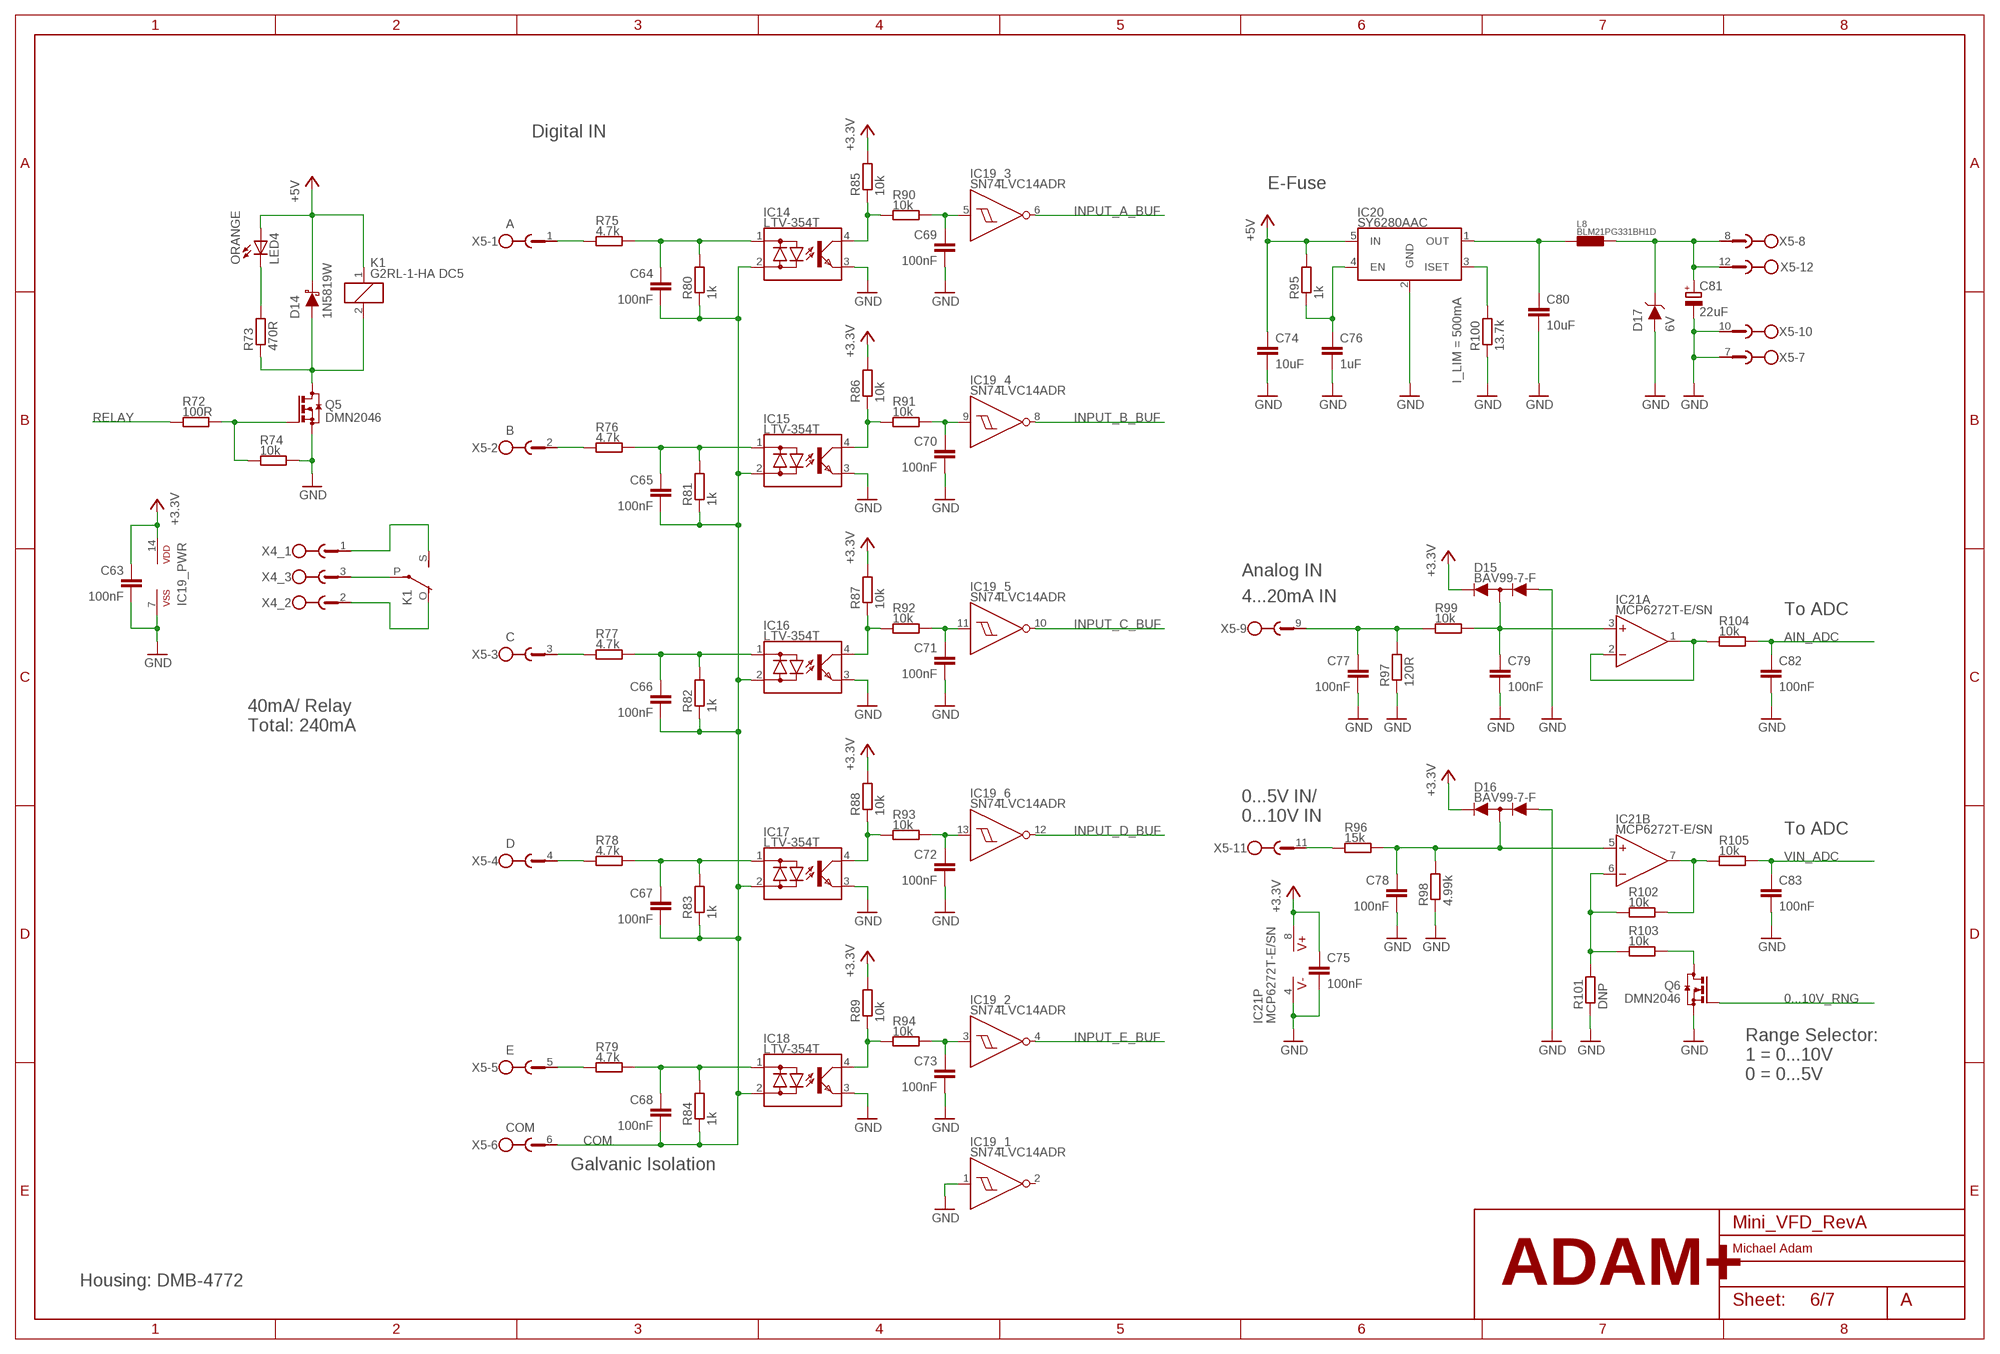
[diagram p5: schematic, sheet 6]

### Parts
C63  100nF  C-EUC0603  [C0603]
C64  100nF  C-EUC0603  [C0603]
C65  100nF  C-EUC0603  [C0603]
C66  100nF  C-EUC0603  [C0603]
C67  100nF  C-EUC0603  [C0603]
C68  100nF  C-EUC0603  [C0603]
C69  100nF  C-EUC0603  [C0603]
C70  100nF  C-EUC0603  [C0603]
C71  100nF  C-EUC0603  [C0603]
C72  100nF  C-EUC0603  [C0603]
C73  100nF  C-EUC0603  [C0603]
C74  10uF  C-EUC0805  [C0805]
C75  100nF  C-EUC0603  [C0603]
C76  1uF  C-EUC0603  [C0603]
C77  100nF  C-EUC0603  [C0603]
C78  100nF  C-EUC0603  [C0603]
C79  100nF  C-EUC0603  [C0603]
C80  10uF  C-EUC0805  [C0805]
C81  22uF  CPOL-EUE2-5  [E2-5]
C82  100nF  C-EUC0603  [C0603]
C83  100nF  C-EUC0603  [C0603]
D14  1N5819W  [SOD123]
D15  BAV99-7-F  BAV99SOT23  [SOT23]
D16  BAV99-7-F  BAV99SOT23  [SOT23]
D17  6V  TVS_DIODE_UNISMA  [DO214AC]
IC14  LTV-354T  LTV354  [SOP04]
IC15  LTV-354T  LTV354  [SOP04]
IC16  LTV-354T  LTV354  [SOP04]
IC17  LTV-354T  LTV354  [SOP04]
IC18  LTV-354T  LTV354  [SOP04]
IC19  SN74LVC14ADR  SN74AC14PWR_SOIC  [SO14]
IC20  SY6280AAC  [SOT23-5]
IC21  MCP6272T-E/SN  LM358D  [SO08]
K1  G2RL-1-HA DC5  E3206S  [E3206S]
L8  BLM21PG331BH1D  BEAD0805  [R0805]
LED4  ORANGE  LED_0603  [LED_0603]
Q5  DMN2046  NMOS_DMN2046  [SOT23]
Q6  DMN2046  NMOS_DMN2046  [SOT23]
R72  100R  R-EU_R0603  [R0603]
R73  470R  R-EU_R0603  [R0603]
R74  10k  R-EU_R0603  [R0603]
R75  4.7k  R-EU_R0805  [R0805]
R76  4.7k  R-EU_R0805  [R0805]
R77  4.7k  R-EU_R0805  [R0805]
R78  4.7k  R-EU_R0805  [R0805]
R79  4.7k  R-EU_R0805  [R0805]
R80  1k  R-EU_R0603  [R0603]
R81  1k  R-EU_R0603  [R0603]
R82  1k  R-EU_R0603  [R0603]
R83  1k  R-EU_R0603  [R0603]
R84  1k  R-EU_R0603  [R0603]
R85  10k  R-EU_R0603  [R0603]
R86  10k  R-EU_R0603  [R0603]
R87  10k  R-EU_R0603  [R0603]
R88  10k  R-EU_R0603  [R0603]
R89  10k  R-EU_R0603  [R0603]
R90  10k  R-EU_R0603  [R0603]
R91  10k  R-EU_R0603  [R0603]
R92  10k  R-EU_R0603  [R0603]
R93  10k  R-EU_R0603  [R0603]
R94  10k  R-EU_R0603  [R0603]
R95  1k  R-EU_R0603  [R0603]
R96  15k  R-EU_R0603  [R0603]
R97  120R  R-EU_R1206  [R1206]
R98  4.99k  R-EU_R0603  [R0603]
R99  10k  R-EU_R0603  [R0603]
R100  13.7k  R-EU_R0603  [R0603]
R101  DNP  R-EU_R0603  [R0603]  (not fitted in variant Assembly_1)
R102  10k  R-EU_R0603  [R0603]
R103  10k  R-EU_R0603  [R0603]
R104  10k  R-EU_R0603  [R0603]
R105  10k  R-EU_R0603  [R0603]
X4  MSTBV3  [MSTBV3]
X5  MSTBV12  [MSTBV12]

### Nets
0...10V_RNG: Q6.1(G) ; also sheet 7
!INPUT_A: IC14.4(C) R85.1 R90.1
!INPUT_A_FILT: C69.1 IC19.5(_3:I) R90.2
!INPUT_B: IC15.4(C) R86.1 R91.1
!INPUT_B_FILT: C70.1 IC19.9(_4:I) R91.2
!INPUT_C: IC16.4(C) R87.1 R92.1
!INPUT_C_FILT: C71.1 IC19.11(_5:I) R92.2
!INPUT_D: IC17.4(C) R88.1 R93.1
!INPUT_D_FILT: C72.1 IC19.13(_6:I) R93.2
!INPUT_E: IC18.4(C) R89.1 R94.1
!INPUT_E_FILT: C73.1 IC19.3(_2:I) R94.2
+3.3V: C63.1 C75.1 D15.2(C) D16.2(C) IC19.14(_PWR:VDD) IC21.8(P:V+) R85.2 R86.2 R87.2 R88.2 R89.2 ; also sheet 3,5,7
+5V: C74.1 D14.1(C) IC20.5(IN) K1.1 LED4.A R95.2 ; also sheet 3,7
+5V_OUT: C81.+ D17.C L8.2 X5.8 X5.12
AIN_ADC: C82.1 R104.2 ; also sheet 7
COM: C64.2 C65.2 C66.2 C67.2 C68.2 IC14.2(AC2) IC15.2(AC2) IC16.2(AC2) IC17.2(AC2) IC18.2(AC2) R80.1 R81.1 R82.1 R83.1 R84.1 X5.6
GND: C63.2 C69.2 C70.2 C71.2 C72.2 C73.2 C74.2 C75.2 C76.2 C77.2 C78.2 C79.2 C80.2 C81.- C82.2 C83.2 D15.1(A) D16.1(A) D17.A IC14.3(E) IC15.3(E) IC16.3(E) IC17.3(E) IC18.3(E) IC19.1(_1:I) IC19.7(_PWR:VSS) IC20.2(GND) IC21.4(P:V-) Q5.2(S) Q6.2(S) R74.2 R97.1 R98.1 R100.1 R101.1 X5.7 X5.10 ; also sheet 3,5,7
IN_A: R75.1 X5.1
IN_A_OPTO: C64.1 IC14.1(AC1) R75.2 R80.2
IN_B: R76.1 X5.2
IN_B_OPTO: C65.1 IC15.1(AC1) R76.2 R81.2
IN_C: R77.1 X5.3
IN_C_OPTO: C66.1 IC16.1(AC1) R77.2 R82.2
IN_D: R78.1 X5.4
IN_D_OPTO: C67.1 IC17.1(AC1) R78.2 R83.2
IN_E: R79.1 X5.5
IN_E_OPTO: C68.1 IC18.1(AC1) R79.2 R84.2
INPUT_A_BUF: IC19.6(_3:O) ; also sheet 7
INPUT_B_BUF: IC19.8(_4:O) ; also sheet 7
INPUT_C_BUF: IC19.10(_5:O) ; also sheet 7
INPUT_D_BUF: IC19.12(_6:O) ; also sheet 7
INPUT_E_BUF: IC19.4(_2:O) ; also sheet 7
N$4: LED4.C R73.2
N$24: C77.1 R97.2 R99.1 X5.9
N$26: IC20.3(ISET) R100.2
N$27: C79.1 D15.3(AC) IC21.3(A:+IN) R99.2
N$36: C76.1 IC20.4(EN) R95.1
N$83: IC21.1(A:OUT) IC21.2(A:-IN) R104.1
N$84: C78.1 D16.3(AC) IC21.5(B:+IN) R96.2 R98.2
N$85: R96.1 X5.11
N$86: IC21.7(B:OUT) R102.2 R105.1
N$87: IC21.6(B:-IN) R101.2 R102.1 R103.2
N$88: Q6.3(D) R103.1
N$90: C80.1 IC20.1(OUT) L8.1
N$96: K1.P(2:P) X4.3
N$97: K1.O(2:O) X4.2
N$98: K1.S(2:S) X4.1
RELAY: R72.1 ; also sheet 7
RELAY_DRAIN: D14.2(A) K1.2 Q5.3(D) R73.1
RELAY_R: Q5.1(G) R72.2 R74.1
VIN_ADC: C83.1 R105.2 ; also sheet 7
Unconnected: IC19.2(_1:O)

### Notes on the sheet
- Digital IN
- E-Fuse
- A
- I_LIM = 500mA
- B
- Analog IN
- 4...20mA IN
- To ADC
- C
- 40mA/ Relay
  Total: 240mA
- 0...5V IN/
  0...10V IN
- To ADC
- D
- E
- Range Selector:
  1 = 0...10V
  0 = 0...5V
- COM
- Galvanic Isolation
- Housing: DMB-4772

## Sheet 7 of 7: MCU
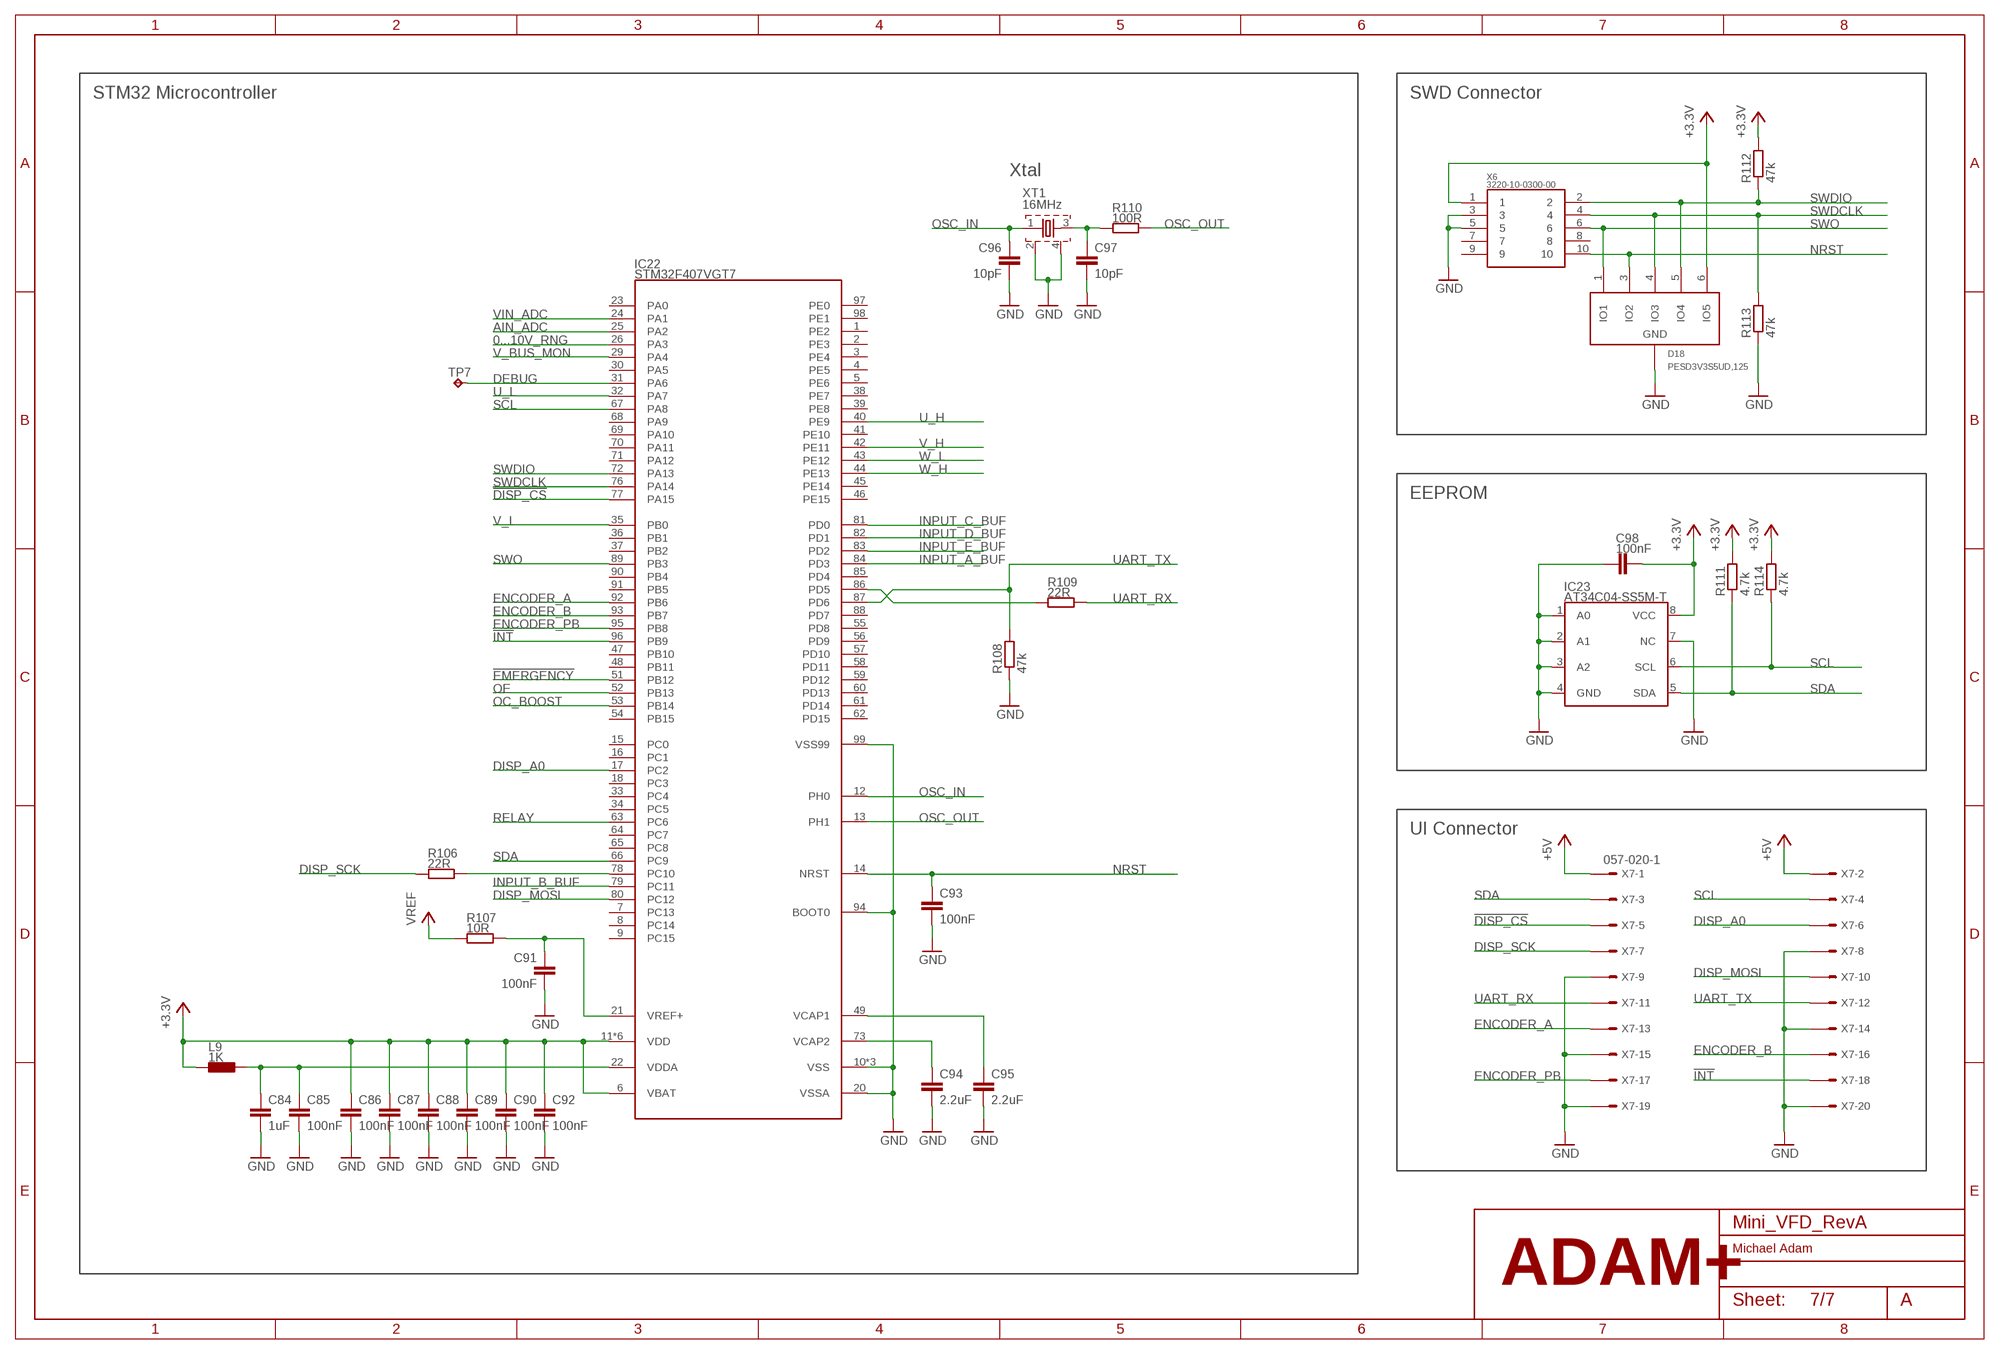
[diagram p6: schematic, sheet 7]

### Parts
C84  1uF  C-EUC0603  [C0603]
C85  100nF  C-EUC0603  [C0603]
C86  100nF  C-EUC0603  [C0603]
C87  100nF  C-EUC0603  [C0603]
C88  100nF  C-EUC0603  [C0603]
C89  100nF  C-EUC0603  [C0603]
C90  100nF  C-EUC0603  [C0603]
C91  100nF  C-EUC0603  [C0603]
C92  100nF  C-EUC0603  [C0603]
C93  100nF  C-EUC0603  [C0603]
C94  2.2uF  C-EUC0603  [C0603]
C95  2.2uF  C-EUC0603  [C0603]
C96  10pF  C-EUC0603  [C0603]
C97  10pF  C-EUC0603  [C0603]
C98  100nF  C-EUC0603  [C0603]
D18  PESD3V3S5UD,125  [TSOP-6]
IC22  STM32F407VGT7  STM32F407VGT6  [LQFP100]
IC23  AT34C04-SS5M-T  AT34C04-X5M-T_SOIC  [SOIC8]
L9  1K  BEAD0603  [R0603]
R106  22R  R-EU_R0603  [R0603]
R107  10R  R-EU_R0603  [R0603]
R108  47k  R-EU_R0603  [R0603]
R109  22R  R-EU_R0603  [R0603]
R110  100R  R-EU_R0603  [R0603]
R111  4.7k  R-EU_R0603  [R0603]
R112  47k  R-EU_R0603  [R0603]
R113  47k  R-EU_R0603  [R0603]
R114  4.7k  R-EU_R0603  [R0603]
TP7  TP_SOLDREYE  [SOLDER_EYE]
X6  3220-10-0300-00  [3220-10-0300-00]
X7  057-020-1  [057-020-1]
XT1  16MHz  CRYSTAL_322516MHZ  [3225_4P]

### Nets
0...10V_RNG: IC22.26(PA3) ; also sheet 6
!DISP_CS: IC22.77(PA15) X7.5
!EMERGENCY: IC22.51(PB12) ; also sheet 5
!INT: IC22.96(PB9) X7.18
+3.3V: C86.1 C87.1 C88.1 C89.1 C90.1 C92.1 C98.2 D18.6(IO5) IC22.6(VBAT) IC22.11(VDD) IC22.19(VDD) IC22.28(VDD) IC22.50(VDD) IC22.75(VDD) IC22.100(VDD) IC23.8(VCC) L9.2 R111.2 R112.2 R114.2 X6.1 ; also sheet 3,5,6
+3.3V_FILT: C84.1 C85.1 IC22.22(VDDA) L9.1
+5V: X7.1 X7.2 ; also sheet 3,6
AIN_ADC: IC22.25(PA2) ; also sheet 6
DEBUG: IC22.31(PA6) TP7.1(TP)
DISP_A0: IC22.17(PC2) X7.6
DISP_MOSI: IC22.80(PC12) X7.10
DISP_SCK: R106.1 X7.7
ENCODER_A: IC22.92(PB6) X7.13
ENCODER_B: IC22.93(PB7) X7.16
ENCODER_PB: IC22.95(PB8) X7.17
GND: C84.2 C85.2 C86.2 C87.2 C88.2 C89.2 C90.2 C91.2 C92.2 C93.2 C94.2 C95.2 C96.2 C97.2 C98.1 D18.2(GND) IC22.10(VSS) IC22.20(VSSA) IC22.27(VSS) IC22.74(VSS) IC22.94(BOOT0) IC22.99(VSS99) IC23.1(A0) IC23.2(A1) IC23.3(A2) IC23.4(GND) IC23.7(NC) R108.1 R113.1 X6.3 X6.5 X7.8 X7.9 X7.14 X7.15 X7.19 X7.20 XT1.2 XT1.4 ; also sheet 3,5,6
INPUT_A_BUF: IC22.84(PD3) ; also sheet 6
INPUT_B_BUF: IC22.79(PC11) ; also sheet 6
INPUT_C_BUF: IC22.81(PD0) ; also sheet 6
INPUT_D_BUF: IC22.82(PD1) ; also sheet 6
INPUT_E_BUF: IC22.83(PD2) ; also sheet 6
N$10: IC22.78(PC10) R106.2
N$11: IC22.86(PD5) R109.1
N$94: C94.1 IC22.73(VCAP2)
N$95: C95.1 IC22.49(VCAP1)
N$99: C97.1 R110.1 XT1.3
N$101: C91.1 IC22.21(VREF+) R107.2
NRST: C93.1 D18.3(IO2) IC22.14(NRST) X6.10
OC_BOOST: IC22.53(PB14) ; also sheet 5
OE: IC22.52(PB13) ; also sheet 5
OSC_IN: C96.1 IC22.12(PH0) XT1.1
OSC_OUT: IC22.13(PH1) R110.2
RELAY: IC22.63(PC6) ; also sheet 6
SCL: IC22.67(PA8) IC23.6(SCL) R114.1 X7.4
SDA: IC22.66(PC9) IC23.5(SDA) R111.1 X7.3
SWDCLK: D18.4(IO3) IC22.76(PA14) R113.2 X6.4
SWDIO: D18.5(IO4) IC22.72(PA13) R112.1 X6.2
SWO: D18.1(IO1) IC22.89(PB3) X6.6
U_H: IC22.40(PE9) ; also sheet 5
U_L: IC22.32(PA7) ; also sheet 5
UART_RX: R109.2 X7.11
UART_TX: IC22.87(PD6) R108.2 X7.12
V_BUS_MON: IC22.29(PA4) ; also sheet 5
V_H: IC22.42(PE11) ; also sheet 5
V_L: IC22.35(PB0) ; also sheet 5
VIN_ADC: IC22.24(PA1) ; also sheet 6
VREF: R107.1 ; also sheet 3
W_H: IC22.44(PE13) ; also sheet 5
W_L: IC22.43(PE12) ; also sheet 5
Unconnected: IC22.1(PE2) IC22.2(PE3) IC22.3(PE4) IC22.4(PE5) IC22.5(PE6) IC22.7(PC13) IC22.8(PC14) IC22.9(PC15) IC22.15(PC0) IC22.16(PC1) IC22.18(PC3) IC22.23(PA0) IC22.30(PA5) IC22.33(PC4) IC22.34(PC5) IC22.36(PB1) IC22.37(PB2) IC22.38(PE7) IC22.39(PE8) IC22.41(PE10) IC22.45(PE14) IC22.46(PE15) IC22.47(PB10) IC22.48(PB11) IC22.54(PB15) IC22.55(PD8) IC22.56(PD9) IC22.57(PD10) IC22.58(PD11) IC22.59(PD12) IC22.60(PD13) IC22.61(PD14) IC22.62(PD15) IC22.64(PC7) IC22.65(PC8) IC22.68(PA9) IC22.69(PA10) IC22.70(PA11) IC22.71(PA12) IC22.85(PD4) IC22.88(PD7) IC22.90(PB4) IC22.91(PB5) IC22.97(PE0) IC22.98(PE1) X6.7 X6.8 X6.9

### Notes on the sheet
- STM32 Microcontroller | SWD Connector
- Xtal
- EEPROM
- UI Connector

## Library data of the parts
C1-C4 C10 C11 C16-C21 C23-C26 C28-C32 C34-C62 C84-C92 C94-C97 = rcl_MICHAEL:C-EU: CAPACITOR, European symbol; SPICEPREFIX: C
C5-C9 C12-C15 C22 C27 C33 C81 C99 = rcl_MICHAEL:CPOL-EU: POLARIZED CAPACITOR, European symbol; SPICEPREFIX: C
C63-C80 C82 C83 C93 C98 = rcl_MICHAEL (1):C-EU: CAPACITOR, European symbol; SPICEPREFIX: C
CY1-CY3 = rcl_MICHAEL:CY: Y CAPACITOR for power line; SPICEPREFIX: C
D1-D7 D9-D12 = lib_CASE_STUDY19:DIODE: Diodes
D8 D17 = lib_CASE_STUDY19:TVS_DIODE_UNI: Unipolar TVS Diode
D13 = lib_CASE_STUDY19:ZENER: Zener Diode
D14 = lib_CASE_STUDY19:1N5819: DIODE SCHOTTKY 40V 1A SOD123; OC: 1655-1N5819WCT-ND; SUPPLIER: Digikey
D15 D16 = lib_CASE_STUDY19:BAV99: DIODE ARRAY GP 75V 300MA SOT23-3; OC: BAV99-FDICT-ND; SUPPLIER: Digikey
D18 = Diodes:PESD3V3S5UD,125: TVS DIODE 3.3V 12V 6TSOP; OC: 1727-5792-1-ND; SUPPLIER: Digikey
F1 = lib_CASE_STUDY19:FUSE: Fuse Holders
H1-H9 = holes:MOUNT-PAD-ROUND: MOUNTING PAD, round
IC1 = lib_CASE_STUDY19:VIPER: IC OFFLINE SWITCH MULT TOP 7DIP; OC: 497-12990-5-ND; SUPPLIER: Digikey
IC2 = lib_CASE_STUDY19:CT817C: 5000Vrms TransistorOptocouplers DC SMD-4 Optocouplers - Phototransistor Output ROHS; OC: C127186; SUPPLIER: Digikey
IC3 = lib_CASE_STUDY19:431: IC VREF SHUNT ADJ; OC: AN431AN-ATRG1DICT-ND; SUPPLIER: Digikey
IC4 = lib_CASE_STUDY19:TPS56339: PWR MGMT SPECIALIZED REGULATOR; OC: 296-53568-1-ND; SUPPLIER: Digikey
IC5 = lib_CASE_STUDY19:SPX1117: IC REG LINEAR 3.3V 800MA SOT223; OC: 1016-1848-1-ND; SUPPLIER: Digikey
IC6 = lib_CASE_STUDY19:REF3025: IC VREF SERIES 0.2% SOT23-3; OC: C11334; SUPPLIER: LCSC
IC7 = lib_CASE_STUDY19:78: IC REG LINEAR 78xx; OC: C7543; SUPPLIER: LCSC
IC8 = lib_CASE_STUDY19:STGIPN3H60: IGBT IPM MODULE 3A 600V NDIP-26L; OC: 497-12114-ND; SUPPLIER: Digikey
IC9 = lib_CASE_STUDY19:LM321: IC OPAMP GP 1 CIRCUIT SOT23-5; OC: C18723612; SUPPLIER: LCSC; VALUE: LM321
IC10 = lib_CASE_STUDY19:π131E60: SOIC-16-300mil Digital Isolators ROHS; OC: C6807828; SUPPLIER: LCSC
IC11 = lib_CASE_STUDY19:π160E60: Digital Isolators ROHS; OC: C6807819; SUPPLIER: LCSC
IC12 = lib_CASE_STUDY19:AMC1200: IC OPAMP ISOLATION 1 CIRC; OC: C79905; SUPPLIER: LCSC
IC13 = lib_CASE_STUDY19:74*541: IC BUFF NON-INVERT 5.5V 20SOIC; OC: nan; SUPPLIER: nan
IC14-IC18 = lib_CASE_STUDY19:LTV354: OPTOISOLATOR 3.75KV TRANS 4-SOP; OC: C119090; SUPPLIER: LCSC
IC19 = lib_CASE_STUDY19:SN74AC14PWR: IC INVERTER SCHMITT 6CH; OC: C133541; SUPPLIER: LCSC
IC20 = lib_CASE_STUDY19:SY6280AAC: SOT-23-5 PMIC - Power Distribution Switches RoHS; OC: C55136; SUPPLIER: LCSC
IC21 = linear_MICHAEL:LM358: OP AMP also LM158; LM258; LM2904 Source: http://cache.national.com/ds/LM/LM158.pdf
IC22 = lib_CASE_STUDY19:STM32F407VGT6: IC MCU 32BIT 1MB FLASH 100LQFP; OC: 497-17438-ND; SUPPLIER: Digikey
IC23 = lib_CASE_STUDY19:AT34C04-X5M-T: IC EEPROM 4K I2C 1MHZ; OC: 1611-AT34C04-SS5M-TCT-ND; SUPPLIER: Digikey
K1 = relay_MICHAEL:E3206S: RELAY 1 x switch, Eichhoff/distributor Schukat; OC_FARNELL: unknown; OC_NEWARK: unknown
L1 = lib_CASE_STUDY19:COMMON_MODE_CHOKE: Common mode chokes; OC: C30584775; SUPPLIER: LCSC
L2 = lib_CASE_STUDY19:COIL: Coil; OC: C364094; SUPPLIER: LCSC
L3 = lib_CASE_STUDY19:COIL: Coil; OC: C5119626; SUPPLIER: LCSC
L4 = lib_CASE_STUDY19:COIL: Coil; OC: C41407036; SUPPLIER: LCSC
L5-L9 = rcl_MICHAEL:BEAD: Ferrite Bead
LED1-LED4 = lib_CASE_STUDY19:LED: LED
NTC1 = lib_CASE_STUDY19:NTC: NTC; OC: C157727; SUPPLIER: LCSC
Q1 = lib_CASE_STUDY19:PMOS: PMOS MOSFET; OC: DMP1045U-7DICT-ND; SUPPLIER: Digikey
Q2 = lib_CASE_STUDY19:NMOS: NMOS General purpose; OC: C536820; SUPPLIER: LCSC
Q3-Q6 = lib_CASE_STUDY19:NMOS: NMOS General purpose; OC: DMN2046U-7DICT-ND; SUPPLIER: Digikey
R1 = varistor:S10K175: VARISTOR
R2 R7 R8 R27-R32 R35-R45 R47-R64 R66 R67 R69 R71-R114 = rcl_MICHAEL (1):R-EU_: RESISTOR, European symbol; SPICEPREFIX: R
R3-R6 R9-R26 R33 R34 R46 R65 R68 R70 = rcl_MICHAEL:R-EU_: RESISTOR, European symbol; SPICEPREFIX: R
T1 = WE-OLSTM:750370024: WE-OLSTM Offline Flyback Transformers Characteristics Nominal input voltage: 85–265 VAC (120–375 VDC) Operating temperature: –40 °C to +125 °C Isolation voltage: 2 kVAC up to 5 kVAC Multiple output options Options for fixed frequency or quasi-resonant mode operation Most products meet reinforced insulation Applications Offline-switch mode power supplies Especially designed for several ICs from STMicroelectronics Auxiliary power supply Home appliances Consumer electronics <https://www.we-online.com/components/media/o781306v209%20FAMILY-MID-OLSTM.jpg> Details see: www.we-online.com/en/components/products/WE-OLSTM <www.we-online.com/en/components/products/WE-OLSTM/?utm_source=eagle_model&utm_medium=description_link&utm_campaign=eisos_eagle> Created by Leviosa 2024-04-15 2024(C) Wurth Elektronik; DATASHEET-URL: https://www.we-online.com/redexpert/spec/750370024?ae; FSWITCH: 115kHz; IOUT1: 500mA; ISAT: 340mA; L: 1.6mH; MOUNT: THT; N: 8:1:1.33; PART-NUMBER: 750370024; SIZE: EE13/7/4; VAUX: 16V; VIN: 85 - 424 V (AC); VOUT1: 12V; VT: 4000V(AC)
TP1-TP11 = lib_CASE_STUDY19:TP: Test pad
X1 X4 = lib_CASE_STUDY19:MSTBV3: PHOENIX
X2 = Connectors:DF3E-2P-2V: CONN HEADER 2POS 2MM; OC: H2094-ND; SUPPLIER: Digikey
X3 = lib_CASE_STUDY19:MSTBV4: PHOENIX
X5 = lib_CASE_STUDY19:MSTBV12: PHOENIX; OC_FARNELL: unknown; OC_NEWARK: unknown
X6 = Connectors:3220-10-0300-00: CONN HEADER SMD 10POS 1.27MM/ CONN HEADER SMD 10POS 1.27MM TR; OC: 1175-1629-ND; SUPPLIER: Digikey
X7 = con-panduit:057-020-: CONNECTOR 20-pin series 057 contact pc board low profile headers; OC_FARNELL: unknown; OC_NEWARK: unknown
XT1 = lib_CASE_STUDY19:CRYSTAL_3225: 3225 Package X-Tal; OC: C521589; SUPPLIER: LCSC

## Net classes
0 default: width 0.15 mm, drill 0.2 mm, clearance 0.2 mm
1 High_Voltage: width 0.2 mm, drill 0.2 mm, clearance 2.5 mm to class 0, clearance 2.5 mm